# Altium project Ultrascale.PrjPcb (part 3 of 9)

## Sheet JTAG.SchDoc
size A3
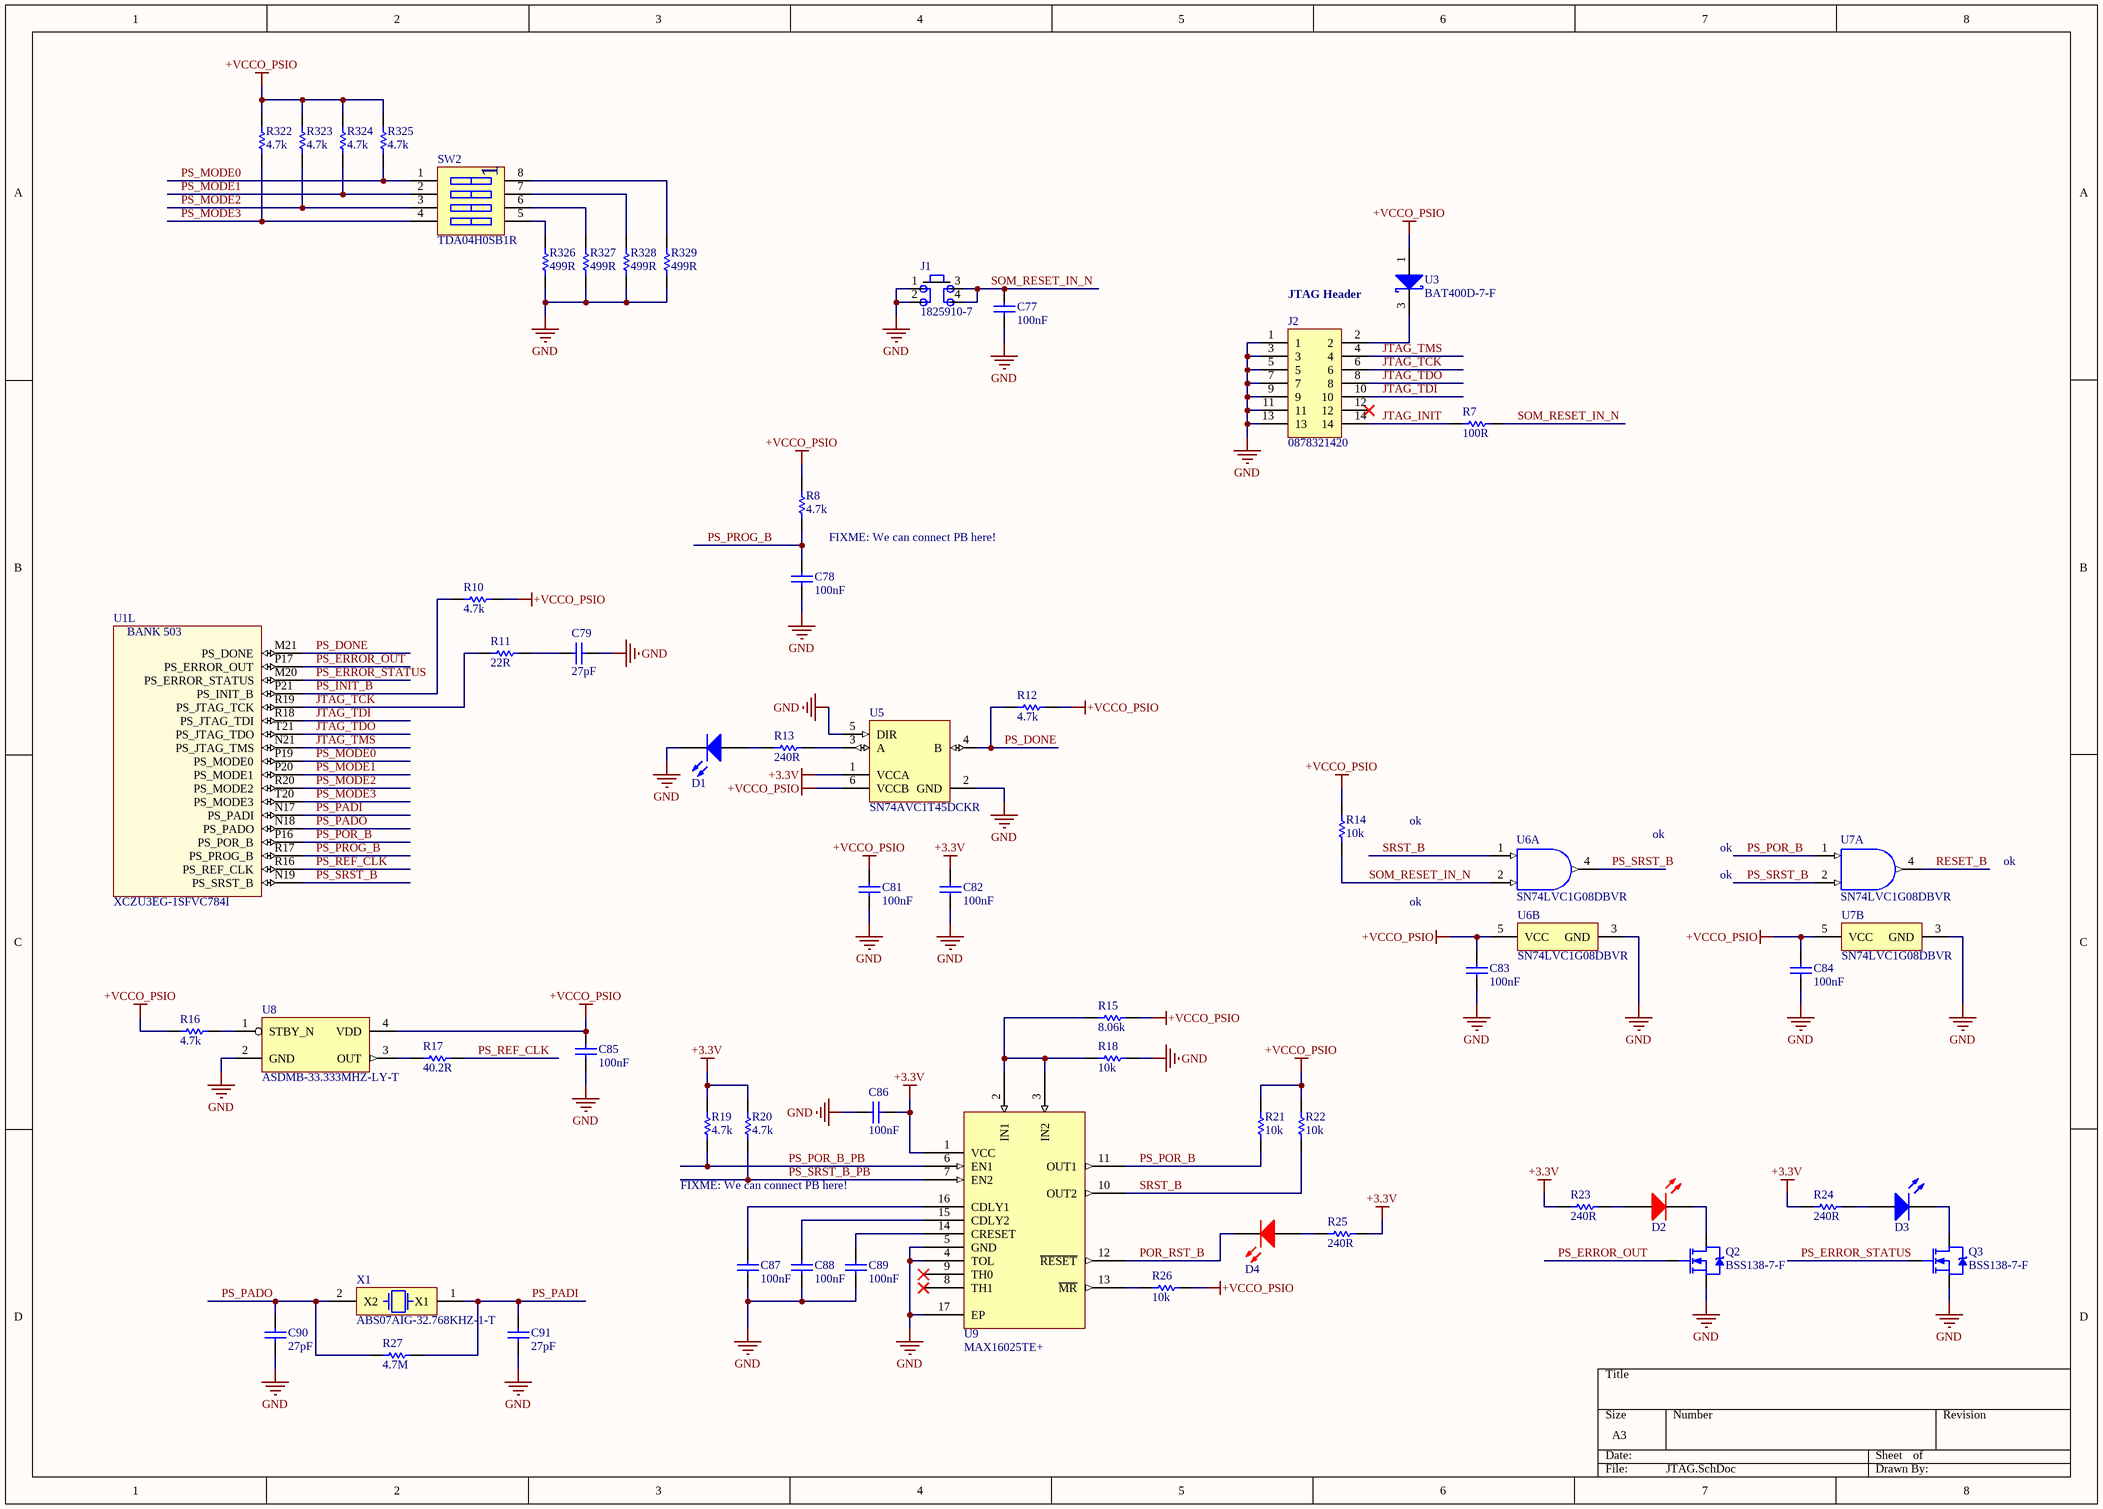
[diagram p7: JTAG.SchDoc]

### Parts
C77  100nF  [CAPC1005L_0402]
C78  100nF  [CAPC1005L_0402]
C79  27pF  [CAPC1005L_0402]
C81  100nF  [CAPC1005L_0402]
C82  100nF  [CAPC1005L_0402]
C83  100nF  [CAPC1005L_0402]
C84  100nF  [CAPC1005L_0402]
C85  100nF  [CAPC1005L_0402]
C86  100nF  [CAPC1005L_0402]
C87  100nF  [CAPC1005L_0402]
C88  100nF  [CAPC1005L_0402]
C89  100nF  [CAPC1005L_0402]
C90  27pF  [CAPC1005L_0402]
C91  27pF  [CAPC1005L_0402]
D1  LED0603BLUE  [LED0603BLUE]  (value not drawn)
D2  LED0603RED  [LED0603RED]  (value not drawn)
D3  LED0603GREEN  [LED0603GREEN]  (value not drawn)
D4  LED0603RED  [LED0603RED]  (value not drawn)
J1  1825910-7  [PB_1825910-7]
J2  0878321420  [0878321420]
Q2  BSS138-7-F  [DIODES_SOT23]
Q3  BSS138-7-F  [DIODES_SOT23]
R7  value 100R  [RESC1005L_0402]  (hidden comment: RES0402_100R_0W1_1T)
R8  value 4.7k  [RESC1005L_0402]  (hidden comment: RES0402_4K7_0W1_1T)
R10  value 4.7k  [RESC1005L_0402]  (hidden comment: RES0402_4K7_0W1_1T)
R11  value 22R  [RESC1005L_0402]  (hidden comment: RES0402_22R_0W1_1T)
R12  value 4.7k  [RESC1005L_0402]  (hidden comment: RES0402_4K7_0W1_1T)
R13  value 240R  [RESC1005L_0402]  (hidden comment: RES0402_240R_0W1_1T)
R14  value 10k  [RESC1005L_0402]  (hidden comment: RES0402_10K_0W1_05T)
R15  value 8.06k  [RESC1005L_0402]  (hidden comment: RES0402_8K06_0W1_1T)
R16  value 4.7k  [RESC1005L_0402]  (hidden comment: RES0402_4K7_0W1_1T)
R17  value 40.2R  [RESC1005L_0402]  (hidden comment: RES0402_40R2_0W1_1T)
R18  value 10k  [RESC1005L_0402]  (hidden comment: RES0402_10K_0W1_05T)
R19  value 4.7k  [RESC1005L_0402]  (hidden comment: RES0402_4K7_0W1_1T)
R20  value 4.7k  [RESC1005L_0402]  (hidden comment: RES0402_4K7_0W1_1T)
R21  value 10k  [RESC1005L_0402]  (hidden comment: RES0402_10K_0W1_05T)
R22  value 10k  [RESC1005L_0402]  (hidden comment: RES0402_10K_0W1_05T)
R23  value 240R  [RESC1005L_0402]  (hidden comment: RES0402_240R_0W1_1T)
R24  value 240R  [RESC1005L_0402]  (hidden comment: RES0402_240R_0W1_1T)
R25  value 240R  [RESC1005L_0402]  (hidden comment: RES0402_240R_0W1_1T)
R26  value 10k  [RESC1005L_0402]  (hidden comment: RES0402_10K_0W1_05T)
R27  value 4.7M  [RESC1005L_0402]  (hidden comment: RES0402_4M7_0W1_5T)
R322  value 4.7k  [RESC1005L_0402]  (hidden comment: RES0402_4K7_0W1_1T)
R323  value 4.7k  [RESC1005L_0402]  (hidden comment: RES0402_4K7_0W1_1T)
R324  value 4.7k  [RESC1005L_0402]  (hidden comment: RES0402_4K7_0W1_1T)
R325  value 4.7k  [RESC1005L_0402]  (hidden comment: RES0402_4K7_0W1_1T)
R326  value 499R  [RESC1005L_0402]  (hidden comment: RES0402_499R_0W1_1T)
R327  value 499R  [RESC1005L_0402]  (hidden comment: RES0402_499R_0W1_1T)
R328  value 499R  [RESC1005L_0402]  (hidden comment: RES0402_499R_0W1_1T)
R329  value 499R  [RESC1005L_0402]  (hidden comment: RES0402_499R_0W1_1T)
SW2  TDA04H0SB1R  [4POS_DIP_SWITCH]
U1  XCZU3EG-1SFVC784I  [BGA784x28]  (part L of 22)
U3  BAT400D-7-F  [BAT400D-7-F _SOT23]
U5  SN74AVC1T45DCKR  [DCK0006A_N]
U6  SN74LVC1G08DBVR  [DBV0005A_N]  (parts A,B of 2)
U7  SN74LVC1G08DBVR  [DBV0005A_N]  (parts A,B of 2)
U8  ASDMB-33.333MHZ-LY-T  [ASDMB]
U9  MAX16025TE+  [T1644+4_L]
X1  ABS07AIG-32.768KHZ-1-T  [ABS07]

### Nets
+3.3V: C82.1 C86.1 R19.1 R20.1 R23.1 R24.1 R25.2 U5.1(VCCA) U9.1(VCC)
+VCCO_PSIO: C81.1 C83.1 C84.1 C85.1 R8.1 R10.2 R12.2 R14.1 R15.2 R16.1 R21.1 R22.1 R26.1 R322.2 R323.2 R324.2 R325.2 U3.1(A) U5.6(VCCB) U6.5(VCC) U7.5(VCC) U8.4(VDD)  [project net +VCCAUX]
GND: C77.1 C78.2 C79.2 C81.2 C82.2 C83.2 C84.2 C85.2 C86.2 C87.2 C88.2 C89.2 C90.2 C91.2 D1.2(K) J1.1 J1.2 J2.1 J2.3 J2.5 J2.7 J2.9 J2.11 J2.13 Q2.S Q3.S R18.2 R326.2 R327.2 R328.2 R329.2 U5.2(GND) U5.5(DIR) U6.3(GND) U7.3(GND) U8.2(GND) U9.4(TOL) U9.5(GND) U9.17(EP)
JTAG_INIT: J2.14 R7.1
JTAG_TCK: J2.6 R11.1 U1.R19(PS_JTAG_TCK)
JTAG_TDI: J2.10 U1.R18(PS_JTAG_TDI)
JTAG_TDO: J2.8 U1.T21(PS_JTAG_TDO)
JTAG_TMS: J2.4 U1.N21(PS_JTAG_TMS)
POR_RST_B: D4.2(K) U9.12(~{RESET})
PS_DONE: R12.1 U1.M21(PS_DONE) U5.4(B)
PS_ERROR_OUT: Q2.G U1.P17(PS_ERROR_OUT)
PS_ERROR_STATUS: Q3.G U1.M20(PS_ERROR_STATUS)
PS_INIT_B: R10.1 U1.P21(PS_INIT_B)
PS_MODE0: R325.1 SW2.1 U1.P19(PS_MODE0)
PS_MODE1: R324.1 SW2.2 U1.P20(PS_MODE1)
PS_MODE2: R323.1 SW2.3 U1.R20(PS_MODE2)
PS_MODE3: R322.1 SW2.4 U1.T20(PS_MODE3)
PS_PADI: C91.1 R27.2 U1.N17(PS_PADI) X1.1(X1)
PS_PADO: C90.1 R27.1 U1.N18(PS_PADO) X1.2(X2)
PS_POR_B: R21.2 U1.P16(PS_POR_B) U7.1(A) U9.11(OUT1)
PS_POR_B_PB: R19.2 U9.6(EN1)
PS_PROG_B: C78.1 R8.2 U1.R17(PS_PROG_B)
PS_REF_CLK: R17.2 U1.R16(PS_REF_CLK)
PS_SRST_B: U1.N19(PS_SRST_B) U6.4(Y) U7.2(B)
PS_SRST_B_PB: R20.2 U9.7(EN2)
RESET_B: U7.4(Y)
SOM_RESET_IN_N: C77.2 J1.3 J1.4 R7.2 R14.2 U6.2(B)
SRST_B: R22.2 U6.1(A) U9.10(OUT2)
NetC79_1: C79.1 R11.2
NetC87_1: C87.1 U9.16(CDLY1)
NetC88_1: C88.1 U9.15(CDLY2)
NetC89_1: C89.1 U9.14(CRESET)
NetD1_1: D1.1(A) R13.1
NetD2_1: D2.1(A) R23.2
NetD2_2: D2.2(K) Q2.D
NetD3_1: D3.1(A) R24.2
NetD3_2: D3.2(K) Q3.D
NetD4_1: D4.1(A) R25.1
NetJ2_2: J2.2 U3.3(K)
NetR13_2: R13.2 U5.3(A)
NetR15_1: R15.1 R18.1 U9.2(IN1) U9.3(IN2)
NetR16_2: R16.2 U8.1(STBY_N)
NetR17_1: R17.1 U8.3(OUT)
NetR26_2: R26.2 U9.13(~{MR})
NetR326_1: R326.1 SW2.5
NetR327_1: R327.1 SW2.6
NetR328_1: R328.1 SW2.7
NetR329_1: R329.1 SW2.8

Not connected (* = marked no-connect by the designer): J2 12*; U9 8(TH1)* 9(TH0)*

### Notes on the sheet
- JTAG Header
- FIXME: We can connect PB here!
- ok
- (in symbol XCZU3EG-1SFVC784I, part L) BANK 503

### Library data of the parts
C77 C78 C81-C89 = CAPCER0402X7R100N25V_10T: CAP CER 0.1UF 25V X7R 0402; Manufacturer 1: Murata Electronics North America; Manufacturer Part Number 1: GRM155R71E104KE14D; Tolerance: 10%; Package: 0402; ComponentLink1Description: Datasheet; Value: 100nF; Voltage: 25V; Temperature Coefficient: X7R; Supplier 1: Digi-Key; Supplier Part Number 1: 490-10698-1-ND; Operating Temperature: -55°C ~ 125°C
C79 C90 C91 = CAPCER0402C0G27P50V_5T: CAP CER 27PF 50V C0G/NP0 0402; Manufacturer 1: Murata Electronics North America; Manufacturer Part Number 1: GRM1555C1H270JA01D; Tolerance: 5%; Package: 0402; ComponentLink1Description: Datasheet; Value: 27pF; Voltage: 50V; Temperature Coefficient: C0G/NP0; Supplier 1: Digi-Key; Supplier Part Number 1: 490-5869-1-ND; Operating Temperature: -55°C ~ 125°C
D1 = LED0603BLUE: LED BLUE DIFFUSED 0603 SMD; Manufacturer 1: Broadcom Limited; Manufacturer Part Number 1: HSMR-C191; Voltage - Forward (Vf) (Typ): 3.4V; Current - Test: 20mA; Package: 0603; Supplier 1: Digi-Key; Supplier Part Number 1: 516-2523-1-ND; ComponentLink1Description: Datasheet; ComponentLink1URL: C:\Users\Public\Documents\Altium\AD16\Library\PDF\AV02-0592EN0.pdf
D2 D4 = LED0603RED: LED RED DIFFUSED 0603 SMD; Manufacturer 1: Broadcom Limited; Manufacturer Part Number 1: HSMH-C191; Voltage - Forward (Vf) (Typ): 1.8V; Current - Test: 20mA; Package: 0603; Supplier 1: Digi-Key; Supplier Part Number 1: 516-3067-1-ND; ComponentLink1Description: Datasheet; ComponentLink1URL: C:\Users\Public\Documents\Altium\AD16\Library\PDF\AV02-0592EN0.pdf
D3 = LED0603GREEN: LED GREEN DIFFUSED 0603 SMD; Manufacturer 1: Broadcom Limited; Manufacturer Part Number 1: HSMM-C190; Voltage - Forward (Vf) (Typ): 3.3V; Current - Test: 20mA; Package: 0603; Supplier 1: Digi-Key; Supplier Part Number 1: 516-2833-1-ND; ComponentLink1Description: Datasheet; ComponentLink1URL: C:\Users\Public\Documents\Altium\AD16\Library\PDF\AV02-0592EN0.pdf
J1 = 1825910-7: SWITCH TACTILE SPST-NO 0.05A 24V; Manufacturer 1: TE Connectivity ALCOSWITCH Switches; Opearating Temperature: -35°C ~ 85°C; ComponentLink1Description: Drawing; ComponentLink1URL: C:\Users\Public\Documents\Altium\AD16\Library\PDF\ENG_CD_1825910_C10.pdf; Supplier 1: Digi-Key; Manufacturer Part Number 1: 1825910-7; Supplier Part Number 1: 450-1804-ND
J2 = 0878321420: CONN HEADER 14POS 2MM VERT SMD; Manufacturer 1: Molex, LLC; Number of Positions: 14; Supplier 1: Digi-Key; Manufacturer Part Number 1: 0878321420; Pitch: 2mm; Number of Rows: 2; ComponentLink1URL: C:\Users\Public\Documents\Altium\AD16\Library\PDF\878322620_sd.pdf; ComponentLink1Description: Drawing; Supplier Part Number 1: 952-1809-ND
Q2 Q3 = BSS138-7-F: MOSFET N-CH 50V 200MA SOT23-3; Manufacturer 1: Diodes Incorporated; ComponentLink1Description: Datasheet; ComponentLink1URL: C:\Users\Public\Documents\Altium\AD16\Library\PDF\ds30144.pdf; Supplier 1: Digi-Key; Supplier Part Number 1: BSS138-FDICT-ND; Manufacturer Part Number 1: BSS138-7-F; Operating Temperature: -55°C ~ 150°C (TJ)
R7 = RES0402_100R_0W1_1T: RES SMD 100 OHM 1% 1/10W 0402; Manufacturer 1: Panasonic Electronic Components; Manufacturer Part Number 1: ERJ-2RKF1000X; Package: 0402; ComponentLink1Description: Datasheet; Power: 1/10W; Tolerance: 1%; Supplier 1: Digi-Key; Supplier Part Number 1: P100LCT-ND
R8 R10 R12 R16 R19 R20 R322-R325 = RES0402_4K7_0W1_1T: RES SMD 4.7K OHM 1% 1/10W 0402; Manufacturer 1: Panasonic Electronic Components; Manufacturer Part Number 1: ERJ-2RKF4701X; Package: 0402; ComponentLink1Description: Datasheet; Power: 1/10W; Tolerance: 1%; Supplier 1: Digi-Key; Supplier Part Number 1: P4.70KLCT-ND
R11 = RES0402_22R_0W1_1T: RES SMD 22 OHM 1% 1/10W 0402; Manufacturer 1: Panasonic Electronic Components; Manufacturer Part Number 1: ERJ-2RKF22R0X; Package: 0402; ComponentLink1Description: Datasheet; Power: 1/10W; Tolerance: 1%; Supplier 1: Digi-Key; Supplier Part Number 1: P22.0LCT-ND
R13 R23-R25 = RES0402_240R_0W1_1T: RES SMD 240 OHM 1% 1/10W 0402; Manufacturer 1: Panasonic Electronic Components; Manufacturer Part Number 1: ERJ-2RKF2400X; Package: 0402; ComponentLink1Description: Datasheet; Power: 1/10W; Tolerance: 1%; Supplier 1: Digi-Key; Supplier Part Number 1: P240LCT-ND
R14 R18 R21 R22 R26 = RES0402_10K_0W1_05T: RES SMD 10K OHM 0.5% 1/16W 0402; Manufacturer 1: Panasonic Electronic Components; Manufacturer Part Number 1: ERJ-2RHD1002X; Package: 0402; ComponentLink1Description: Datasheet; Power: 1/16W; Tolerance: 0.5%; Supplier 1: Digi-Key; Supplier Part Number 1: P15984CT-ND
R15 = RES0402_8K06_0W1_1T: RES SMD 8.06K OHM 1% 1/10W 0402; Manufacturer 1: Panasonic Electronic Components; Manufacturer Part Number 1: ERJ-2RKF8061X; Package: 0402; ComponentLink1Description: Datasheet; Power: 1/10W; Tolerance: 1%; Supplier 1: Digi-Key; Supplier Part Number 1: P8.06KLCT-ND
R17 = RES0402_40R2_0W1_1T: RES SMD 40.2 OHM 1% 1/10W 0402; Manufacturer 1: Panasonic Electronic Components; Manufacturer Part Number 1: ERJ-2RKF40R2X; Package: 0402; ComponentLink1Description: Datasheet; Power: 1/10W; Tolerance: 1%; Supplier 1: Digi-Key; Supplier Part Number 1: P40.2LCT-ND
R27 = RES0402_4M7_0W1_5T: RES SMD 4.7M OHM 5% 1/16W 0402; Manufacturer 1: Vishay Dale; Manufacturer Part Number 1: CRCW04024M70JNED; Power: 1/10W; Package: 0402; ComponentLink1Description: Datasheet; Tolerance: 5%; Supplier 1: Digi-Key; Supplier Part Number 1: 541-4.7MJCT-ND
R326-R329 = RES0402_499R_0W1_1T: RES SMD 499 OHM 1% 1/16W 0402; Manufacturer 1: Vishay Dale; Manufacturer Part Number 1: CRCW0402499RFKTD; Power: 1/10W; Package: 0402; ComponentLink1Description: Datasheet; Tolerance: 1%; Supplier 1: Digi-Key; Supplier Part Number 1: 541-2962-1-ND
SW2 = TDA04H0SB1R: SWITCH SLIDE DIP SPST 25MA 24V; Manufacturer 1: C&K; Pitch: 1.27mm; Number of Contact: 4; Supplier 1: Digi-Key; Manufacturer Part Number 1: TDA04H0SB1R; ComponentLink1URL: C:\Users\Public\Documents\Altium\AD16\Library\PDF\tda.pdf; ComponentLink1Description: Drawing; Supplier Part Number 1: CKN9502CT-ND
U1 = XCZU3EG-1SFVC784I: IC FPGA 252 I/O 784FCBGA - XILINX ZYNQ ULTRASCALE+; Manufacturer 1: Xilinx Inc.; Package: SFVC784; ComponentLink1Description: Datasheet; Supplier 1: Digi-Key; Supplier Part Number 1: XCZU3EG-1SFVC784I-ND; Manufacturer Part Number 1: XCZU3EG-1SFVC784I
U3 = BAT400D-7-F: DIODE SCHOTTKY 40V 500MA SOT23-3; Manufacturer 1: Diodes Incorporated; ComponentLink1Description: Datasheet; ComponentLink1URL: C:\Users\Public\Documents\Altium\AD16\Library\PDF\ds30182.pdf; Supplier 1: Digi-Key; Supplier Part Number 1: BAT400D-FDICT-ND; Manufacturer Part Number 1: BAT400D-7-F; Operating Temperature: -40°C ~ 125°C
U5 = SN74AVC1T45DCKR: Single-Bit Dual-Supply Bus Transceiver with Configurable Voltage Translation and 3-State Outputs, DCK0006A, LARGE T&R; Manufacturer 1: Texas Instruments; VCC(Min)(V): 1.2; VCC(Max)(V): 3.6; Output Type: CMOS; Logic: True; ICC @ Nom Voltage(Max)(mA): 0.0009; Bits(#): 1; F @ Nom Voltage(Max)(Mhz): 100; Rating: Catalog; Technology Family: AVC; Voltage(Nom)(V): 1.2,1.5,1.8,2.5,3.3; Schmitt Trigger: No; Output Drive (IOL/IOH)(Max)(mA): 12/-12; Sub-Family: Dual Supply Translator; 3-State Output: Yes; tpd @ Nom Voltage(Max)(ns): 2.9,5.6,5.2,4.2,3.8; DatasheetVersion: SCES530H; PackageReference: DCK0006A; Supplier 2: Mouser; Supplier Part Number 2: 595-SN74AVC1T45DCKR; Supplier 1: Digi-Key; Supplier Part Number 1: 296-17992-2-ND; Supplier 3: Digi-Key; Supplier Part Number 3: 296-17992-1-ND; Supplier 4: Digi-Key; Supplier Part Number 4: 296-17992-6-ND; Generic Part Number: SN74AVC1T45; Input Type: CMOS; Operating Temperature Range(C): -40 to 85; Manufacturer Part Number 1: SN74AVC1T45DCKR; ComponentLink1Description: Manufacturer URL; ComponentLink1URL: C:\Users\Public\Documents\Altium\AD16\Library\PDF\sn74avc1t45.pdf
U6 U7 = SN74LVC1G08DBVR: Single 2-Input Positive-AND Gate, DBV0005A, LARGE T&R; Manufacturer 1: Texas Instruments; VCC(Min)(V): 1.65; VCC(Max)(V): 5.5; Output Type: CMOS; ICC @ Nom Voltage(Max)(mA): 0.01; Input Type: CMOS/TTL; Bits(#): 1; F @ Nom Voltage(Max)(Mhz): 150; Rating: Catalog; Technology Family: LVC; Voltage(Nom)(V): 1.8,2.5,3.3,5; Schmitt Trigger: No; Output Drive (IOL/IOH)(Max)(mA): 32/-32; tpd @ Nom Voltage(Max)(ns): 4.5,6,4,5; Logic: True; Gate Type: AND; DatasheetVersion: SCES217Y; PackageReference: DBV0005A; Supplier 2: Mouser; Supplier Part Number 2: 595-SN74LVC1G08DBVR; Supplier 1: Digi-Key; Supplier Part Number 1: 296-11601-2-ND; Supplier 3: Digi-Key; Supplier Part Number 3: 296-11601-1-ND; Supplier 4: Digi-Key; Supplier Part Number 4: 296-11601-6-ND; Generic Part Number: SN74LVC1G08; Operating Temperature: -40°C ~ 125°C; Sub-Family: AND Gate; 3-State Output: No; Manufacturer Part Number 1: SN74LVC1G08DBVR; ComponentLink1Description: Manufacturer URL; ComponentLink1URL: C:\Users\Public\Documents\Altium\AD16\Library\PDF\sn74lvc1g08.pdf
U8 = ASDMB-33.333MHZ-LY-T: OSC MEMS 33.333MHZ CMOS SMD; Manufacturer 1: Abracon LLC; Frequency Stability: ±10ppm; ComponentLink1Description: Datasheet; ComponentLink1URL: C:\Users\Public\Documents\Altium\AD16\Library\PDF\ASDMB.pdf; Supplier 1: Digi-Key; Supplier Part Number 1: 535-11196-1-ND; Manufacturer Part Number 1: ASDMB-33.333MHZ-LY-T; Operating Temperature: -40°C ~ 85°C; Frequency: 33.333MHz
U9 = MAX16025TE+: IC SUPERVISORY CIRC DL 16TQFN; Manufacturer 1: Maxim Integrated; ComponentLink1Description: Datasheet; ComponentLink1URL: C:\Users\Public\Documents\Altium\AD16\Library\PDF\MAX16025-MAX16030.pdf; Supplier 1: Digi-Key; Supplier Part Number 1: MAX16025TE+-ND; Manufacturer Part Number 1: MAX16025TE+; Operating Temperature: -40°C ~ 125°C (TA)
X1 = ABS07AIG-32.768KHZ-1-T: CRYSTAL 32.768KHZ 12.5PF SMD; Manufacturer 1: Abracon LLC; Frequency Tolerance: ±10ppm; ComponentLink1Description: Datasheet; ComponentLink1URL: C:\Users\Public\Documents\Altium\AD16\Library\PDF\ABS07.pdf; Supplier 1: Digi-Key; Supplier Part Number 1: 535-13352-1-ND; Manufacturer Part Number 1: ABS07AIG-32.768KHZ-1-T; Operating Temperature: -40°C ~ 125°C; Load Capacitance: 12.5pF; Frequency: 32.768kHz

## Sheet SYSMON.SchDoc
size A3
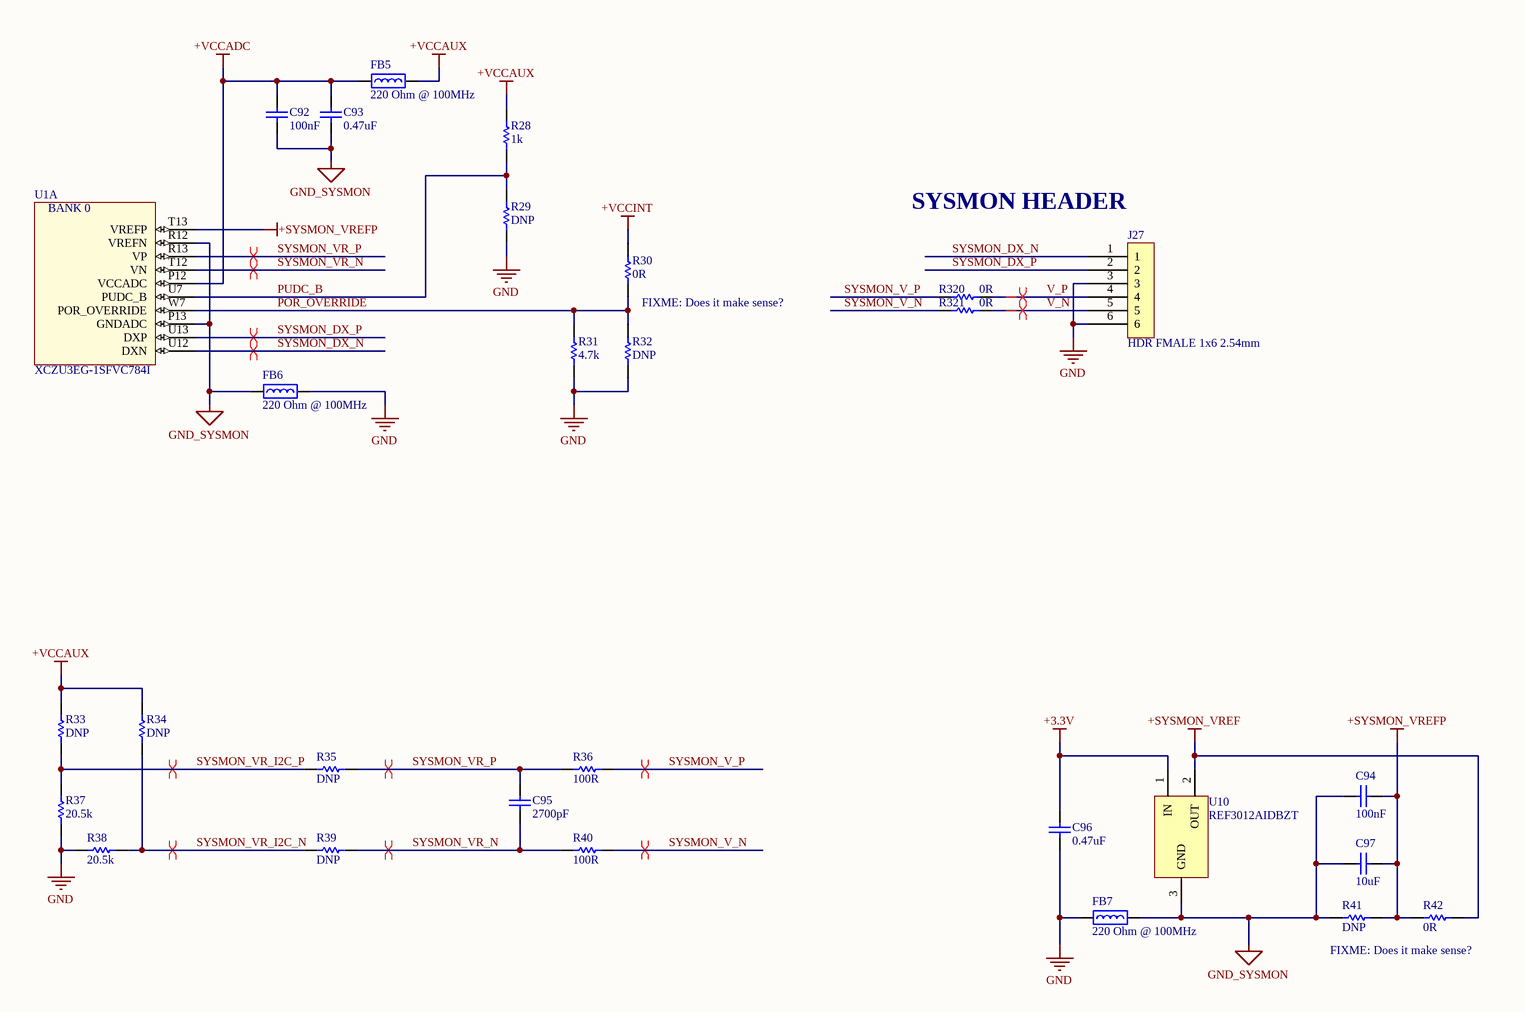
[diagram p8: SYSMON.SchDoc]

### Parts
C92  100nF  [CAPC1005L_0402]
C93  0.47uF  [CAPC1005L_0402]
C94  100nF  [CAPC1005L_0402]
C95  2700pF  [CAPC1005L_0402]
C96  0.47uF  [CAPC1005L_0402]
C97  10uF  [CAPC1005L_0402]
FB5  Impedance @ Frequency: 220 Ohm @ 100MHz  [INDC1608N_0603]  (hidden comment: BEAD0603_220_2A5_40M)
FB6  Impedance @ Frequency: 220 Ohm @ 100MHz  [INDC1608N_0603]  (hidden comment: BEAD0603_220_2A5_40M)
FB7  Impedance @ Frequency: 220 Ohm @ 100MHz  [INDC1608N_0603]  (hidden comment: BEAD0603_220_2A5_40M)
J27  HDR FMALE 1x6 2.54mm  [Hdr_Female_1x6_2.54mm]
R28  value 1k  [RESC1005L_0402]  (hidden comment: RES0402_1K_0W1_1T)
R29  value DNP  [RESC1005L_0402]  (hidden comment: RES0402)
R30  value 0R  [RESC1005L_0402]  (hidden comment: RES0402_0R_0W1)
R31  value 4.7k  [RESC1005L_0402]  (hidden comment: RES0402_4K7_0W1_1T)
R32  value DNP  [RESC1005L_0402]  (hidden comment: RES0402)
R33  value DNP  [RESC1005L_0402]  (hidden comment: RES0402)
R34  value DNP  [RESC1005L_0402]  (hidden comment: RES0402)
R35  value DNP  [RESC1005L_0402]  (hidden comment: RES0402)
R36  value 100R  [RESC1005L_0402]  (hidden comment: RES0402_100R_0W1_1T)
R37  value 20.5k  [RESC1005L_0402]  (hidden comment: RES0402_20K5_0W1_1T)
R38  value 20.5k  [RESC1005L_0402]  (hidden comment: RES0402_20K5_0W1_1T)
R39  value DNP  [RESC1005L_0402]  (hidden comment: RES0402)
R40  value 100R  [RESC1005L_0402]  (hidden comment: RES0402_100R_0W1_1T)
R41  value DNP  [RESC1005L_0402]  (hidden comment: RES0402)
R42  value 0R  [RESC1005L_0402]  (hidden comment: RES0402_0R_0W1)
R320  value 0R  [RESC1005L_0402]  (hidden comment: RES0402_0R_0W1)
R321  value 0R  [RESC1005L_0402]  (hidden comment: RES0402_0R_0W1)
U1  XCZU3EG-1SFVC784I  [BGA784x28]  (part A of 22)
U10  REF3012AIDBZT  [TI-DBZ3_N]

### Nets
+3.3V: C96.1 U10.1(IN)
+SYSMON_VREF: R42.1 U10.2(OUT)
+SYSMON_VREFP: C94.1 C97.2 R41.1 R42.2 U1.T13(VREFP)
+VCCADC: C92.1 C93.1 FB5.1 U1.P12(VCCADC)
+VCCAUX: FB5.2 R28.1 R33.1 R34.1
+VCCINT: R30.1
GND: C96.2 FB6.2 FB7.1 J27.3 J27.6 R29.2 R31.2 R32.2 R37.2 R38.2
GND_SYSMON: C92.2 C93.2 C94.2 C97.1 FB6.1 FB7.2 R41.2 U1.P13(GNDADC) U1.R12(VREFN) U10.3(GND)
POR_OVERRIDE: R30.2 R31.1 R32.1 U1.W7(POR_OVERRIDE)
PUDC_B: R28.2 R29.1 U1.U7(PUDC_B)
SYSMON_DX_N: J27.1 U1.U12(DXN)
SYSMON_DX_P: J27.2 U1.U13(DXP)
SYSMON_V_N: R40.2 R321.1
SYSMON_V_P: R36.2 R320.1
SYSMON_VR_I2C_N: R34.2 R38.1 R39.2
SYSMON_VR_I2C_P: R33.2 R35.2 R37.1
SYSMON_VR_N: C95.2 R39.1 R40.1 U1.T12(VN)
SYSMON_VR_P: C95.1 R35.1 R36.1 U1.R13(VP)
V_N: J27.5 R321.2
V_P: J27.4 R320.2

### Layout directives
differential pair: SYSMON_DX_N, SYSMON_DX_P, SYSMON_V_N, SYSMON_V_P, SYSMON_VR_I2C_N, SYSMON_VR_I2C_P, SYSMON_VR_N, SYSMON_VR_P, V_N, V_P

### Notes on the sheet
- SYSMON HEADER
- FIXME: Does it make sense?
- (in symbol XCZU3EG-1SFVC784I, part A) BANK 0

### Library data of the parts
C92 C94 = CAPCER0402X7R100N25V_10T: as C77 on sheet JTAG; Package: 0402; ComponentLink1Description: Datasheet; Value: 100nF; Voltage: 25V; Temperature Coefficient: X7R; Supplier 1: Digi-Key; Supplier Part Number 1: 490-10698-1-ND; Operating Temperature: -55°C ~ 125°C
C93 C96 = CAPCER0402X5R0U4710V_10T: CAP CER 0.47UF 10V X5R 0402; Manufacturer 1: Murata Electronics North America; Manufacturer Part Number 1: GRM155R61A474KE15D; Tolerance: 10%; Package: 0402; ComponentLink1Description: Datasheet; Value: 0.47uF; Voltage: 10V; Temperature Coefficient: X5R; Supplier 1: Digi-Key; Supplier Part Number 1: 490-3264-1-ND; Operating Temperature: -55°C ~ 85°C
C95 = CAPCER0402X7R2700P50V_10T: CAP CER 2700PF 50V X7R 0402; Manufacturer 1: Murata Electronics North America; Manufacturer Part Number 1: GRM155R71H272KA01D; Tolerance: 10%; Package: 0402; ComponentLink1Description: Datasheet; Value: 2700pF; Voltage: 50V; Temperature Coefficient: X7R; Supplier 1: Digi-Key; Supplier Part Number 1: 490-1306-1-ND; Operating Temperature: -55°C ~ 125°C
C97 = CAPCER0402X5R10U10V_20T: CAP CER 10UF 10V X5R 0402; Manufacturer 1: Samsung Electro-Mechanics America, Inc.; Manufacturer Part Number 1: CL05A106MP5NUNC; Tolerance: 20%; Package: 0402; ComponentLink1Description: Datasheet; Value: 10uF; Voltage: 10V; Temperature Coefficient: X5R; Supplier 1: Digi-Key; Supplier Part Number 1: 1276-1450-1-ND; Operating Temperature: -55°C ~ 85°C
FB5-FB7 = BEAD0603_220_2A5_40M: FERRITE BEAD 220 OHM 0603 1LN; Manufacturer 1: Murata Electronics North America; Manufacturer Part Number 1: BLM18SG221TN1D; Current Rating (Max): 2.5A; DC Resistance (DCR) (Max): 40 mohm; Package: 0603; ComponentLink1Description: Datasheet; ComponentLink1URL: C:\Users\Public\Documents\Altium\AD16\Library\PDF\ENFA0003.pdf; Supplier 1: Digi-Key; Supplier Part Number 1: 490-5225-1-ND; Operating Temperature: -55°C ~ 125°C
J27 = M20-7820646: 06-WAY SIL VERT SOCKET L/FREE; Manufacturer 1: Harwin Inc; Connector Type: Receptacle; Number of Positions: 6; Number of Positions Loaded: All; Pitch: 0.100" (2.54mm); .Checked PCB: MM; Supplier 1: Digi-Key; Manufacturer Part Number 1: M20-7820646; RoHS: RoHS Compliant; Category: Connectors, Interconnects; Stock 1: 87; Pricing 1: 1=0.96, 38=0.79211, 76=0.75895, 114=0.72596, 266=0.66, 532=0.594, 1026=0.528, 2508=0.4785 (USD); Packaging: Tube; Contact Type: Female Socket; Number of Rows: 1; Row Spacing: -; Mounting Type: Through Hole; Termination: Solder; Fastening Type: -; Features: -; Contact Finish: Tin; Contact Finish Thickness: -; Color: Black; ComponentLink1URL: http://harwin.com/includes/pdfs/M20-782.pdf; ComponentLink1Description: http://harwin.com/includes/pdfs/M20-782.pdf; Supplier Part Number 1: 952-1809-ND; .Checked SCH: MM; .Creator: MM
R28 = RES0402_1K_0W1_1T: RES SMD 1K OHM 1% 1/10W 0402; Manufacturer 1: Panasonic Electronic Components; Manufacturer Part Number 1: ERJ-2RKF1001X; Package: 0402; ComponentLink1Description: Datasheet; Power: 1/10W; Tolerance: 1%; Supplier 1: Digi-Key; Supplier Part Number 1: P1.00KLCT-ND
R29 R32-R35 R39 R41 = RES0402: RES SMD 0402 Footprint; Package: 0402; ComponentLink1Description: Datasheet; Tolerance: -
R30 R42 R320 R321 = RES0402_0R_0W1: RES SMD 0 OHM JUMPER 1/10W 0402; Manufacturer 1: Panasonic Electronic Components; Manufacturer Part Number 1: ERJ-2GE0R00X; Package: 0402; ComponentLink1Description: Datasheet; Power: 1/10W; Tolerance: -; Supplier 1: Digi-Key; Supplier Part Number 1: P0.0JCT-ND
R31 = RES0402_4K7_0W1_1T: as R8 on sheet JTAG; Package: 0402; ComponentLink1Description: Datasheet; Power: 1/10W; Tolerance: 1%; Supplier 1: Digi-Key; Supplier Part Number 1: P4.70KLCT-ND
R36 R40 = RES0402_100R_0W1_1T: as R7 on sheet JTAG; Package: 0402; ComponentLink1Description: Datasheet; Power: 1/10W; Tolerance: 1%; Supplier 1: Digi-Key; Supplier Part Number 1: P100LCT-ND
R37 R38 = RES0402_20K5_0W1_1T: RES SMD 20.5K OHM 1% 1/10W 0402; Manufacturer 1: Panasonic Electronic Components; Manufacturer Part Number 1: ERJ-2RKF2052X; Package: 0402; ComponentLink1Description: Datasheet; Power: 1/10W; Tolerance: 1%; Supplier 1: Digi-Key; Supplier Part Number 1: P20.5KLCT-ND
U1 = XCZU3EG-1SFVC784I: as U1 on sheet JTAG; Package: SFVC784; ComponentLink1Description: Datasheet; Supplier 1: Digi-Key; Supplier Part Number 1: XCZU3EG-1SFVC784I-ND; Manufacturer Part Number 1: XCZU3EG-1SFVC784I
U10 = REF3012AIDBZT: IC VREF SERIES 1.25V SOT23-3; Manufacturer 1: Texas Instruments; Voltage - Input: 1.8 V ~ 5.5 V; ComponentLink1Description: Datasheet; ComponentLink1URL: C:\Users\Public\Documents\Altium\AD16\Library\PDF\ref3012.pdf; Supplier 1: Digi-Key; Supplier Part Number 1: REF3012AIDBZTCT-ND; Manufacturer Part Number 1: REF3012AIDBZT; Operating Temperature: -40°C ~ 125°C (TA); Voltage - Output (Min/Fixed): 1.25V

## Sheet PS_DDR4_SODIMM.SchDoc
size A3
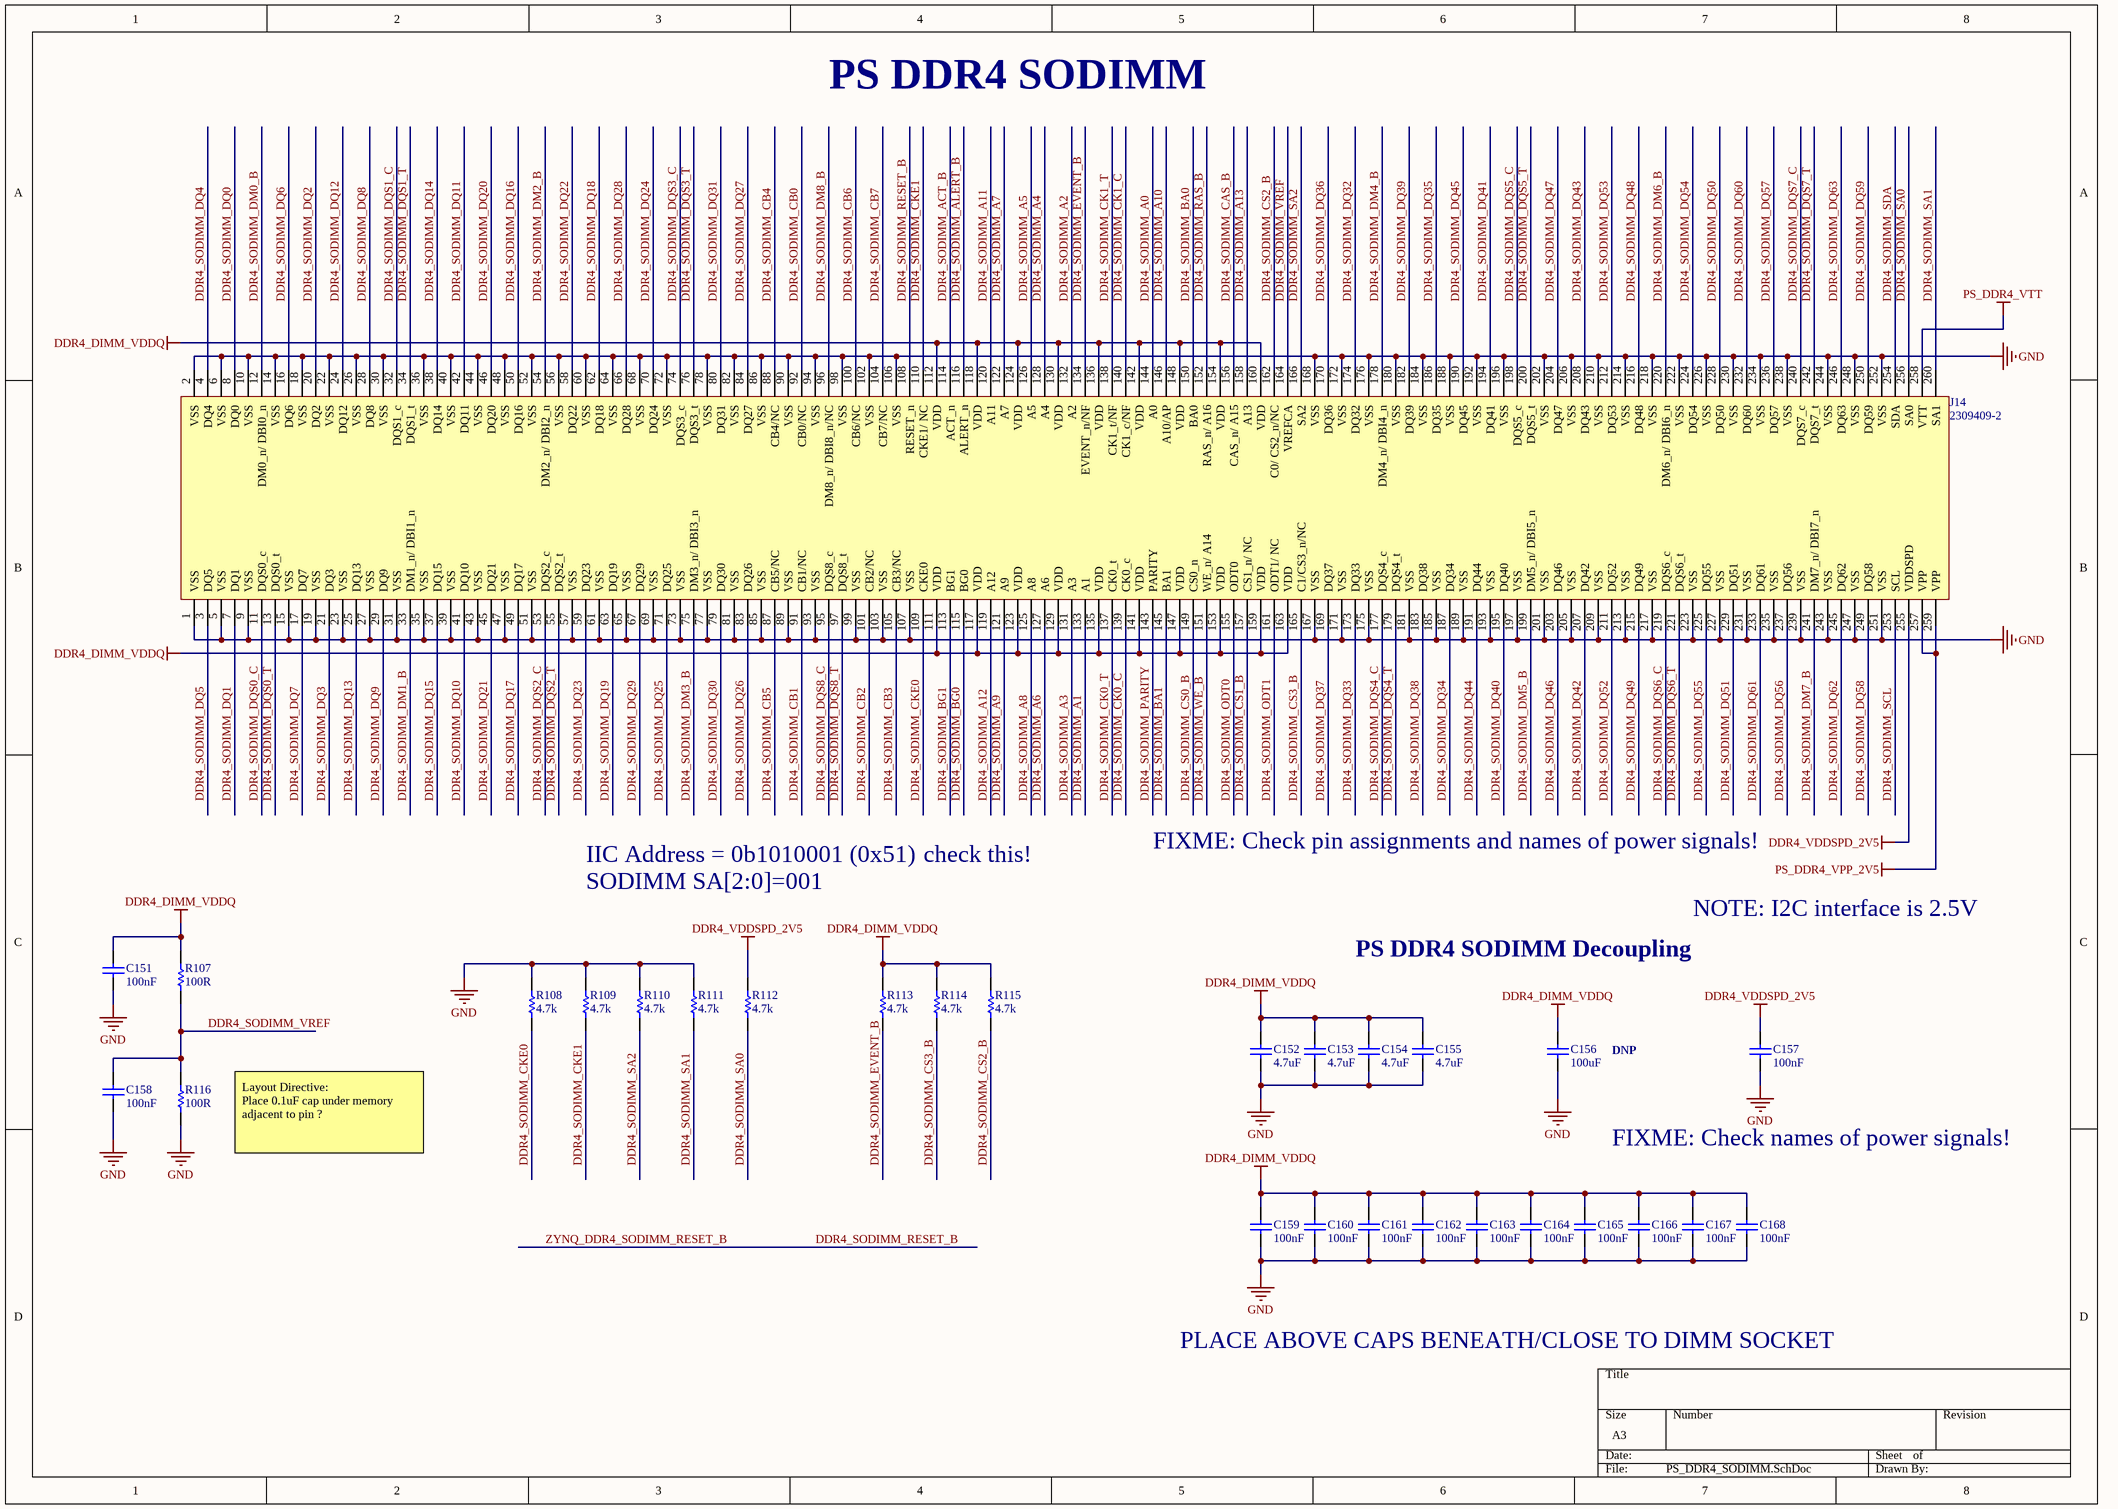
[diagram p9: PS_DDR4_SODIMM.SchDoc]

### Parts
C151  100nF  [CAPC1005L_0402]
C152  4.7uF  [CAPC1005L_0402]
C153  4.7uF  [CAPC1005L_0402]
C154  4.7uF  [CAPC1005L_0402]
C155  4.7uF  [CAPC1005L_0402]
C156  100uF  [CAPC3225N_1210]
C157  100nF  [CAPC1005L_0402]
C158  100nF  [CAPC1005L_0402]
C159  100nF  [CAPC1005L_0402]
C160  100nF  [CAPC1005L_0402]
C161  100nF  [CAPC1005L_0402]
C162  100nF  [CAPC1005L_0402]
C163  100nF  [CAPC1005L_0402]
C164  100nF  [CAPC1005L_0402]
C165  100nF  [CAPC1005L_0402]
C166  100nF  [CAPC1005L_0402]
C167  100nF  [CAPC1005L_0402]
C168  100nF  [CAPC1005L_0402]
J14  2309409-2  [DDR4_SODIMM_MATING]
R107  value 100R  [RESC1005L_0402]  (hidden comment: RES0402_100R_0W1_1T)
R108  value 4.7k  [RESC1005L_0402]  (hidden comment: RES0402_4K7_0W1_1T)
R109  value 4.7k  [RESC1005L_0402]  (hidden comment: RES0402_4K7_0W1_1T)
R110  value 4.7k  [RESC1005L_0402]  (hidden comment: RES0402_4K7_0W1_1T)
R111  value 4.7k  [RESC1005L_0402]  (hidden comment: RES0402_4K7_0W1_1T)
R112  value 4.7k  [RESC1005L_0402]  (hidden comment: RES0402_4K7_0W1_1T)
R113  value 4.7k  [RESC1005L_0402]  (hidden comment: RES0402_4K7_0W1_1T)
R114  value 4.7k  [RESC1005L_0402]  (hidden comment: RES0402_4K7_0W1_1T)
R115  value 4.7k  [RESC1005L_0402]  (hidden comment: RES0402_4K7_0W1_1T)
R116  value 100R  [RESC1005L_0402]  (hidden comment: RES0402_100R_0W1_1T)

### Nets
DDR4_DIMM_VDDQ: C151.2 C152.2 C153.2 C154.2 C155.2 C156.2 C159.2 C160.2 C161.2 C162.2 C163.2 C164.2 C165.2 C166.2 C167.2 C168.2 J14.111(VDD) J14.112(VDD) J14.117(VDD) J14.118(VDD) J14.123(VDD) J14.124(VDD) J14.129(VDD) J14.130(VDD) J14.135(VDD) J14.136(VDD) J14.141(VDD) J14.142(VDD) J14.147(VDD) J14.148(VDD) J14.153(VDD) J14.154(VDD) J14.159(VDD) J14.160(VDD) J14.163(VDD) R107.2 R113.2 R114.2 R115.2
DDR4_VDDSPD_2V5: C157.2 J14.255(VDDSPD) R112.2
GND: C151.1 C152.1 C153.1 C154.1 C155.1 C156.1 C157.1 C158.1 C159.1 C160.1 C161.1 C162.1 C163.1 C164.1 C165.1 C166.1 C167.1 C168.1 J14.1(VSS) J14.2(VSS) J14.5(VSS) J14.6(VSS) J14.9(VSS) J14.10(VSS) J14.14(VSS) J14.15(VSS) J14.18(VSS) J14.19(VSS) J14.22(VSS) J14.23(VSS) J14.26(VSS) J14.27(VSS) J14.30(VSS) J14.31(VSS) J14.35(VSS) J14.36(VSS) J14.39(VSS) J14.40(VSS) J14.43(VSS) J14.44(VSS) J14.47(VSS) J14.48(VSS) J14.51(VSS) J14.52(VSS) J14.56(VSS) J14.57(VSS) J14.60(VSS) J14.61(VSS) J14.64(VSS) J14.65(VSS) J14.68(VSS) J14.69(VSS) J14.72(VSS) J14.73(VSS) J14.77(VSS) J14.78(VSS) J14.81(VSS) J14.82(VSS) J14.85(VSS) J14.86(VSS) J14.89(VSS) J14.90(VSS) J14.93(VSS) J14.94(VSS) J14.98(VSS) J14.99(VSS) J14.102(VSS) J14.103(VSS) J14.106(VSS) J14.107(VSS) J14.167(VSS) J14.168(VSS) J14.171(VSS) J14.172(VSS) J14.175(VSS) J14.176(VSS) J14.180(VSS) J14.181(VSS) J14.184(VSS) J14.185(VSS) J14.188(VSS) J14.189(VSS) J14.192(VSS) J14.193(VSS) J14.196(VSS) J14.197(VSS) J14.201(VSS) J14.202(VSS) J14.205(VSS) J14.206(VSS) J14.209(VSS) J14.210(VSS) J14.213(VSS) J14.214(VSS) J14.217(VSS) J14.218(VSS) J14.222(VSS) J14.223(VSS) J14.226(VSS) J14.227(VSS) J14.230(VSS) J14.231(VSS) J14.234(VSS) J14.235(VSS) J14.238(VSS) J14.239(VSS) J14.243(VSS) J14.244(VSS) J14.247(VSS) J14.248(VSS) J14.251(VSS) J14.252(VSS) R108.2 R109.2 R110.2 R111.2 R116.1
PS_DDR4_VPP_2V5: J14.257(VPP) J14.259(VPP)
PS_DDR4_VTT: J14.258(VTT)
DDR4_SODIMM_A0: J14.144(A0)
DDR4_SODIMM_A1: J14.133(A1)
DDR4_SODIMM_A2: J14.132(A2)
DDR4_SODIMM_A3: J14.131(A3)
DDR4_SODIMM_A4: J14.128(A4)
DDR4_SODIMM_A5: J14.126(A5)
DDR4_SODIMM_A6: J14.127(A6)
DDR4_SODIMM_A7: J14.122(A7)
DDR4_SODIMM_A8: J14.125(A8)
DDR4_SODIMM_A9: J14.121(A9)
DDR4_SODIMM_A10: J14.146(A10/AP)
DDR4_SODIMM_A11: J14.120(A11)
DDR4_SODIMM_A12: J14.119(A12)
DDR4_SODIMM_A13: J14.158(A13)
DDR4_SODIMM_ACT_B: J14.114(ACT_n)
DDR4_SODIMM_ALERT_B: J14.116(ALERT_n)
DDR4_SODIMM_BA0: J14.150(BA0)
DDR4_SODIMM_BA1: J14.145(BA1)
DDR4_SODIMM_BG0: J14.115(BG0)
DDR4_SODIMM_BG1: J14.113(BG1)
DDR4_SODIMM_CAS_B: J14.156(CAS_n/_A15)
DDR4_SODIMM_CB0: J14.92(CB0/NC)
DDR4_SODIMM_CB1: J14.91(CB1/NC)
DDR4_SODIMM_CB2: J14.101(CB2/NC)
DDR4_SODIMM_CB3: J14.105(CB3/NC)
DDR4_SODIMM_CB4: J14.88(CB4/NC)
DDR4_SODIMM_CB5: J14.87(CB5/NC)
DDR4_SODIMM_CB6: J14.100(CB6/NC)
DDR4_SODIMM_CB7: J14.104(CB7/NC)
DDR4_SODIMM_CK0_C: J14.139(CK0_c)
DDR4_SODIMM_CK0_T: J14.137(CK0_t)
DDR4_SODIMM_CK1_C: J14.140(CK1_c/NF)
DDR4_SODIMM_CK1_T: J14.138(CK1_t/NF)
DDR4_SODIMM_CKE0: J14.109(CKE0) R108.1
DDR4_SODIMM_CKE1: J14.110(CKE1/_NC) R109.1
DDR4_SODIMM_CS0_B: J14.149(CS0_n)
DDR4_SODIMM_CS1_B: J14.157(CS1_n/_NC)
DDR4_SODIMM_CS2_B: J14.162(C0/_CS2_n/NC) R115.1
DDR4_SODIMM_CS3_B: J14.165(C1/CS3_n/NC) R114.1
DDR4_SODIMM_DM0_B: J14.12(DM0_n/_DBI0_n)
DDR4_SODIMM_DM1_B: J14.33(DM1_n/_DBI1_n)
DDR4_SODIMM_DM2_B: J14.54(DM2_n/_DBI2_n)
DDR4_SODIMM_DM3_B: J14.75(DM3_n/_DBI3_n)
DDR4_SODIMM_DM4_B: J14.178(DM4_n/_DBI4_n)
DDR4_SODIMM_DM5_B: J14.199(DM5_n/_DBI5_n)
DDR4_SODIMM_DM6_B: J14.220(DM6_n/_DBI6_n)
DDR4_SODIMM_DM7_B: J14.241(DM7_n/_DBI7_n)
DDR4_SODIMM_DM8_B: J14.96(DM8_n/_DBI8_n/NC)
DDR4_SODIMM_DQ0: J14.8(DQ0)
DDR4_SODIMM_DQ1: J14.7(DQ1)
DDR4_SODIMM_DQ2: J14.20(DQ2)
DDR4_SODIMM_DQ3: J14.21(DQ3)
DDR4_SODIMM_DQ4: J14.4(DQ4)
DDR4_SODIMM_DQ5: J14.3(DQ5)
DDR4_SODIMM_DQ6: J14.16(DQ6)
DDR4_SODIMM_DQ7: J14.17(DQ7)
DDR4_SODIMM_DQ8: J14.28(DQ8)
DDR4_SODIMM_DQ9: J14.29(DQ9)
DDR4_SODIMM_DQ10: J14.41(DQ10)
DDR4_SODIMM_DQ11: J14.42(DQ11)
DDR4_SODIMM_DQ12: J14.24(DQ12)
DDR4_SODIMM_DQ13: J14.25(DQ13)
DDR4_SODIMM_DQ14: J14.38(DQ14)
DDR4_SODIMM_DQ15: J14.37(DQ15)
DDR4_SODIMM_DQ16: J14.50(DQ16)
DDR4_SODIMM_DQ17: J14.49(DQ17)
DDR4_SODIMM_DQ18: J14.62(DQ18)
DDR4_SODIMM_DQ19: J14.63(DQ19)
DDR4_SODIMM_DQ20: J14.46(DQ20)
DDR4_SODIMM_DQ21: J14.45(DQ21)
DDR4_SODIMM_DQ22: J14.58(DQ22)
DDR4_SODIMM_DQ23: J14.59(DQ23)
DDR4_SODIMM_DQ24: J14.70(DQ24)
DDR4_SODIMM_DQ25: J14.71(DQ25)
DDR4_SODIMM_DQ26: J14.83(DQ26)
DDR4_SODIMM_DQ27: J14.84(DQ27)
DDR4_SODIMM_DQ28: J14.66(DQ28)
DDR4_SODIMM_DQ29: J14.67(DQ29)
DDR4_SODIMM_DQ30: J14.79(DQ30)
DDR4_SODIMM_DQ31: J14.80(DQ31)
DDR4_SODIMM_DQ32: J14.174(DQ32)
DDR4_SODIMM_DQ33: J14.173(DQ33)
DDR4_SODIMM_DQ34: J14.187(DQ34)
DDR4_SODIMM_DQ35: J14.186(DQ35)
DDR4_SODIMM_DQ36: J14.170(DQ36)
DDR4_SODIMM_DQ37: J14.169(DQ37)
DDR4_SODIMM_DQ38: J14.183(DQ38)
DDR4_SODIMM_DQ39: J14.182(DQ39)
DDR4_SODIMM_DQ40: J14.195(DQ40)
DDR4_SODIMM_DQ41: J14.194(DQ41)
DDR4_SODIMM_DQ42: J14.207(DQ42)
DDR4_SODIMM_DQ43: J14.208(DQ43)
DDR4_SODIMM_DQ44: J14.191(DQ44)
DDR4_SODIMM_DQ45: J14.190(DQ45)
DDR4_SODIMM_DQ46: J14.203(DQ46)
DDR4_SODIMM_DQ47: J14.204(DQ47)
DDR4_SODIMM_DQ48: J14.216(DQ48)
DDR4_SODIMM_DQ49: J14.215(DQ49)
DDR4_SODIMM_DQ50: J14.228(DQ50)
DDR4_SODIMM_DQ51: J14.229(DQ51)
DDR4_SODIMM_DQ52: J14.211(DQ52)
DDR4_SODIMM_DQ53: J14.212(DQ53)
DDR4_SODIMM_DQ54: J14.224(DQ54)
DDR4_SODIMM_DQ55: J14.225(DQ55)
DDR4_SODIMM_DQ56: J14.237(DQ56)
DDR4_SODIMM_DQ57: J14.236(DQ57)
DDR4_SODIMM_DQ58: J14.249(DQ58)
DDR4_SODIMM_DQ59: J14.250(DQ59)
DDR4_SODIMM_DQ60: J14.232(DQ60)
DDR4_SODIMM_DQ61: J14.233(DQ61)
DDR4_SODIMM_DQ62: J14.245(DQ62)
DDR4_SODIMM_DQ63: J14.246(DQ63)
DDR4_SODIMM_DQS0_C: J14.11(DQS0_c)
DDR4_SODIMM_DQS0_T: J14.13(DQS0_t)
DDR4_SODIMM_DQS1_C: J14.32(DQS1_c)
DDR4_SODIMM_DQS1_T: J14.34(DQS1_t)
DDR4_SODIMM_DQS2_C: J14.53(DQS2_c)
DDR4_SODIMM_DQS2_T: J14.55(DQS2_t)
DDR4_SODIMM_DQS3_C: J14.74(DQS3_c)
DDR4_SODIMM_DQS3_T: J14.76(DQS3_t)
DDR4_SODIMM_DQS4_C: J14.177(DQS4_c)
DDR4_SODIMM_DQS4_T: J14.179(DQS4_t)
DDR4_SODIMM_DQS5_C: J14.198(DQS5_c)
DDR4_SODIMM_DQS5_T: J14.200(DQS5_t)
DDR4_SODIMM_DQS6_C: J14.219(DQS6_c)
DDR4_SODIMM_DQS6_T: J14.221(DQS6_t)
DDR4_SODIMM_DQS7_C: J14.240(DQS7_c)
DDR4_SODIMM_DQS7_T: J14.242(DQS7_t)
DDR4_SODIMM_DQS8_C: J14.95(DQS8_c)
DDR4_SODIMM_DQS8_T: J14.97(DQS8_t)
DDR4_SODIMM_EVENT_B: J14.134(EVENT_n/NF) R113.1
DDR4_SODIMM_ODT0: J14.155(ODT0)
DDR4_SODIMM_ODT1: J14.161(ODT1/_NC)
DDR4_SODIMM_PARITY: J14.143(PARITY)
DDR4_SODIMM_RAS_B: J14.152(RAS_n/_A16)
DDR4_SODIMM_RESET_B: J14.108(RESET_n)  [also labelled ZYNQ_DDR4_SODIMM_RESET_B]
DDR4_SODIMM_SA0: J14.256(SA0) R112.1
DDR4_SODIMM_SA1: J14.260(SA1) R111.1
DDR4_SODIMM_SA2: J14.166(SA2) R110.1
DDR4_SODIMM_SCL: J14.253(SCL)  [project net DDR4_SODIMM_PL_SCL]
DDR4_SODIMM_SDA: J14.254(SDA)  [project net DDR4_SODIMM_PL_SDA]
DDR4_SODIMM_VREF: C158.2 J14.164(VREFCA) R107.1 R116.2
DDR4_SODIMM_WE_B: J14.151(WE_n/_A14)

### Notes on the sheet
- PS DDR4 SODIMM
- FIXME: Check pin assignments and names of power signals!
- IIC Address = 0b1010001 (0x51)
- SODIMM SA[2:0]=001
- check this!
- NOTE: I2C interface is 2.5V
- PS DDR4 SODIMM Decoupling
- DNP
- Layout Directive:
  Place 0.1uF cap under memory
  adjacent to pin ?
- FIXME: Check names of power signals!
- PLACE ABOVE CAPS BENEATH/CLOSE TO DIMM SOCKET

### Library data of the parts
C151 C157-C168 = CAPCER0402X7R100N25V_10T: as C77 on sheet JTAG; Package: 0402; ComponentLink1Description: Datasheet; Value: 100nF; Voltage: 25V; Temperature Coefficient: X7R; Supplier 1: Digi-Key; Supplier Part Number 1: 490-10698-1-ND; Operating Temperature: -55°C ~ 125°C
C152-C155 = CAPCER0402X5R4U710V_10T: CAP CER 4.7UF 10V X5R 0402; Manufacturer 1: TDK Corporation; Manufacturer Part Number 1: C1005X5R1A475K050BC; Tolerance: 10%; Package: 0402; ComponentLink1Description: Datasheet; Value: 4.7uF; Voltage: 10V; Temperature Coefficient: x5R; Supplier 1: Digi-Key; Supplier Part Number 1: 445-13820-1-ND; Operating Temperature: -55°C ~ 85°C
C156 = CAPCER1210X5R100U16V_20T: CAP CER 100UF 16V X5R 1210; Manufacturer 1: Taiyo Yuden; Manufacturer Part Number 1: EMK325ABJ107MM-T; Tolerance: 20%; Package: 1210; ComponentLink1Description: Datasheet; Value: 100uF; Voltage: 16V; Temperature Coefficient: X5R; Supplier 1: Digi-Key; Supplier Part Number 1: 587-3152-1-ND; Operating Temperature: -55°C ~ 85°C
J14 = 2309409-2: DDR4 SODIMM 260P 5.2H STD; Manufacturer 1: TE; ComponentLink1Description: Datasheet; ComponentLink1URL: C:\Users\Public\Documents\Altium\AD16\Library\PDF\ENG_CD_2309409_3.pdf; Supplier 1: Digi-Key; Manufacturer Part Number 1: 2309409-2; Operating Temperature: -55 – 85 °C; Height: 5.2mm
R107 R116 = RES0402_100R_0W1_1T: as R7 on sheet JTAG; Package: 0402; ComponentLink1Description: Datasheet; Power: 1/10W; Tolerance: 1%; Supplier 1: Digi-Key; Supplier Part Number 1: P100LCT-ND
R108-R115 = RES0402_4K7_0W1_1T: as R8 on sheet JTAG; Package: 0402; ComponentLink1Description: Datasheet; Power: 1/10W; Tolerance: 1%; Supplier 1: Digi-Key; Supplier Part Number 1: P4.70KLCT-ND

## Sheet PL_DDR4_SODIMM.SchDoc
size A3
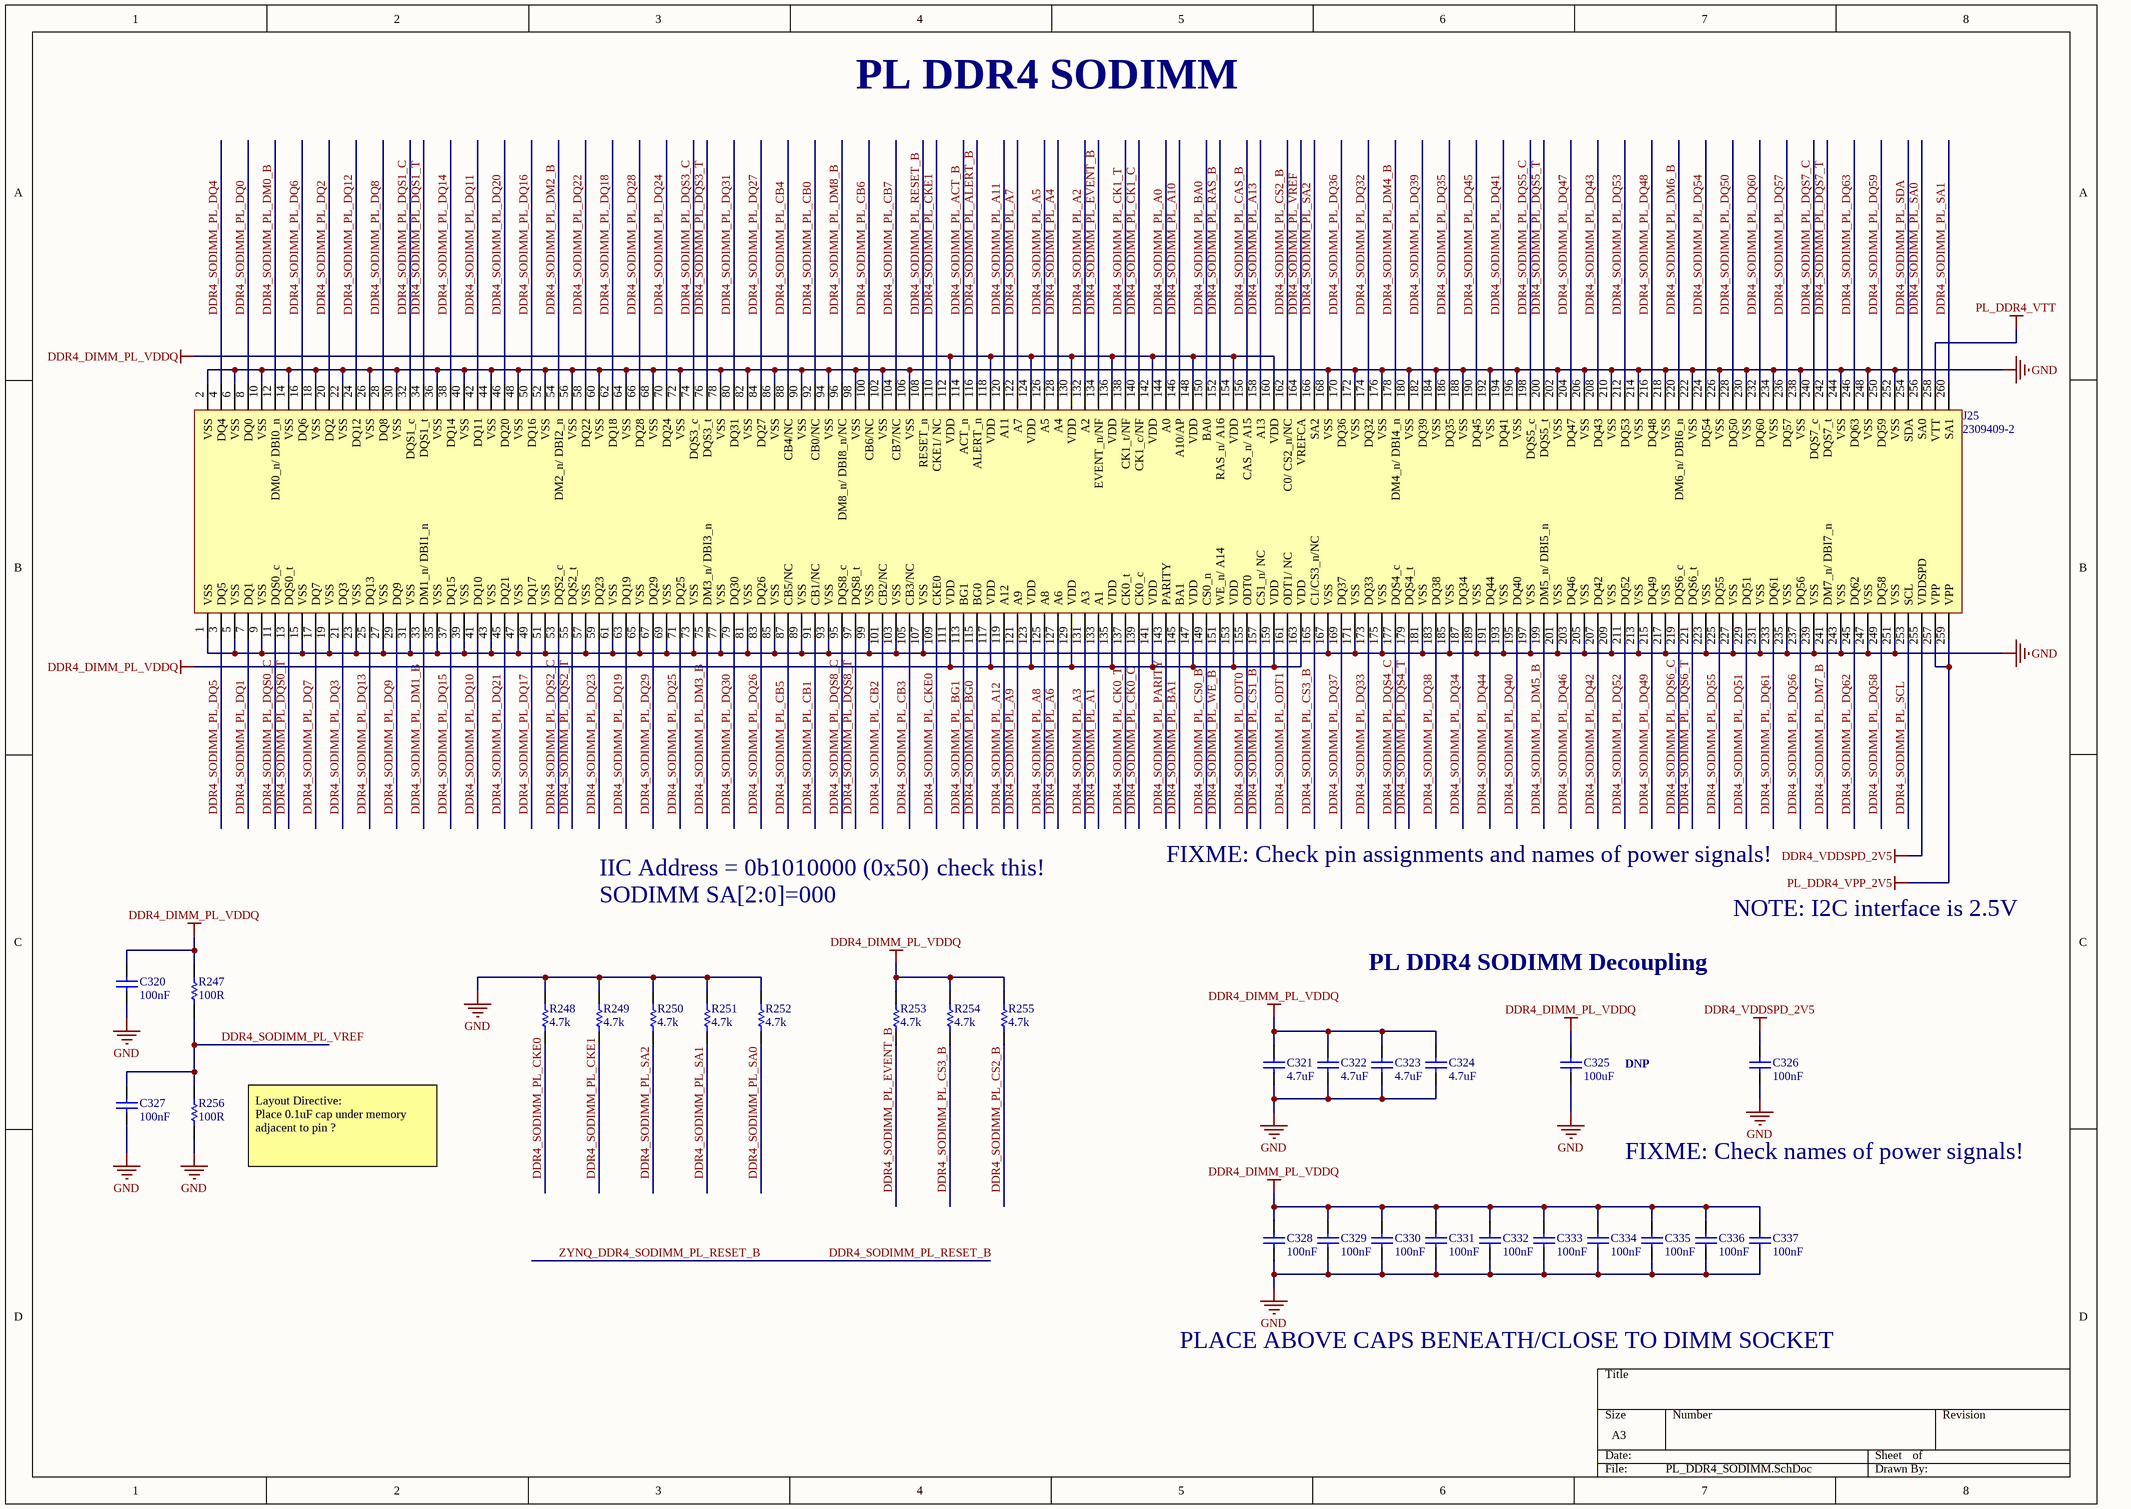
[diagram p10: PL_DDR4_SODIMM.SchDoc]

### Parts
C320  100nF  [CAPC1005L_0402]
C321  4.7uF  [CAPC1005L_0402]
C322  4.7uF  [CAPC1005L_0402]
C323  4.7uF  [CAPC1005L_0402]
C324  4.7uF  [CAPC1005L_0402]
C325  100uF  [CAPC3225N_1210]
C326  100nF  [CAPC1005L_0402]
C327  100nF  [CAPC1005L_0402]
C328  100nF  [CAPC1005L_0402]
C329  100nF  [CAPC1005L_0402]
C330  100nF  [CAPC1005L_0402]
C331  100nF  [CAPC1005L_0402]
C332  100nF  [CAPC1005L_0402]
C333  100nF  [CAPC1005L_0402]
C334  100nF  [CAPC1005L_0402]
C335  100nF  [CAPC1005L_0402]
C336  100nF  [CAPC1005L_0402]
C337  100nF  [CAPC1005L_0402]
J25  2309409-2  [DDR4_SODIMM_MATING]
R247  value 100R  [RESC1005L_0402]  (hidden comment: RES0402_100R_0W1_1T)
R248  value 4.7k  [RESC1005L_0402]  (hidden comment: RES0402_4K7_0W1_1T)
R249  value 4.7k  [RESC1005L_0402]  (hidden comment: RES0402_4K7_0W1_1T)
R250  value 4.7k  [RESC1005L_0402]  (hidden comment: RES0402_4K7_0W1_1T)
R251  value 4.7k  [RESC1005L_0402]  (hidden comment: RES0402_4K7_0W1_1T)
R252  value 4.7k  [RESC1005L_0402]  (hidden comment: RES0402_4K7_0W1_1T)
R253  value 4.7k  [RESC1005L_0402]  (hidden comment: RES0402_4K7_0W1_1T)
R254  value 4.7k  [RESC1005L_0402]  (hidden comment: RES0402_4K7_0W1_1T)
R255  value 4.7k  [RESC1005L_0402]  (hidden comment: RES0402_4K7_0W1_1T)
R256  value 100R  [RESC1005L_0402]  (hidden comment: RES0402_100R_0W1_1T)

### Nets
DDR4_DIMM_PL_VDDQ: C320.2 C321.2 C322.2 C323.2 C324.2 C325.2 C328.2 C329.2 C330.2 C331.2 C332.2 C333.2 C334.2 C335.2 C336.2 C337.2 J25.111(VDD) J25.112(VDD) J25.117(VDD) J25.118(VDD) J25.123(VDD) J25.124(VDD) J25.129(VDD) J25.130(VDD) J25.135(VDD) J25.136(VDD) J25.141(VDD) J25.142(VDD) J25.147(VDD) J25.148(VDD) J25.153(VDD) J25.154(VDD) J25.159(VDD) J25.160(VDD) J25.163(VDD) R247.2 R253.2 R254.2 R255.2  [project net +VCCO_HP_64]
DDR4_VDDSPD_2V5: C326.2 J25.255(VDDSPD)
GND: C320.1 C321.1 C322.1 C323.1 C324.1 C325.1 C326.1 C327.1 C328.1 C329.1 C330.1 C331.1 C332.1 C333.1 C334.1 C335.1 C336.1 C337.1 J25.1(VSS) J25.2(VSS) J25.5(VSS) J25.6(VSS) J25.9(VSS) J25.10(VSS) J25.14(VSS) J25.15(VSS) J25.18(VSS) J25.19(VSS) J25.22(VSS) J25.23(VSS) J25.26(VSS) J25.27(VSS) J25.30(VSS) J25.31(VSS) J25.35(VSS) J25.36(VSS) J25.39(VSS) J25.40(VSS) J25.43(VSS) J25.44(VSS) J25.47(VSS) J25.48(VSS) J25.51(VSS) J25.52(VSS) J25.56(VSS) J25.57(VSS) J25.60(VSS) J25.61(VSS) J25.64(VSS) J25.65(VSS) J25.68(VSS) J25.69(VSS) J25.72(VSS) J25.73(VSS) J25.77(VSS) J25.78(VSS) J25.81(VSS) J25.82(VSS) J25.85(VSS) J25.86(VSS) J25.89(VSS) J25.90(VSS) J25.93(VSS) J25.94(VSS) J25.98(VSS) J25.99(VSS) J25.102(VSS) J25.103(VSS) J25.106(VSS) J25.107(VSS) J25.167(VSS) J25.168(VSS) J25.171(VSS) J25.172(VSS) J25.175(VSS) J25.176(VSS) J25.180(VSS) J25.181(VSS) J25.184(VSS) J25.185(VSS) J25.188(VSS) J25.189(VSS) J25.192(VSS) J25.193(VSS) J25.196(VSS) J25.197(VSS) J25.201(VSS) J25.202(VSS) J25.205(VSS) J25.206(VSS) J25.209(VSS) J25.210(VSS) J25.213(VSS) J25.214(VSS) J25.217(VSS) J25.218(VSS) J25.222(VSS) J25.223(VSS) J25.226(VSS) J25.227(VSS) J25.230(VSS) J25.231(VSS) J25.234(VSS) J25.235(VSS) J25.238(VSS) J25.239(VSS) J25.243(VSS) J25.244(VSS) J25.247(VSS) J25.248(VSS) J25.251(VSS) J25.252(VSS) R248.2 R249.2 R250.2 R251.2 R252.2 R256.1
PL_DDR4_VPP_2V5: J25.257(VPP) J25.259(VPP)
PL_DDR4_VTT: J25.258(VTT)
DDR4_SODIMM_PL_A0: J25.144(A0)
DDR4_SODIMM_PL_A1: J25.133(A1)
DDR4_SODIMM_PL_A2: J25.132(A2)
DDR4_SODIMM_PL_A3: J25.131(A3)
DDR4_SODIMM_PL_A4: J25.128(A4)
DDR4_SODIMM_PL_A5: J25.126(A5)
DDR4_SODIMM_PL_A6: J25.127(A6)
DDR4_SODIMM_PL_A7: J25.122(A7)
DDR4_SODIMM_PL_A8: J25.125(A8)
DDR4_SODIMM_PL_A9: J25.121(A9)
DDR4_SODIMM_PL_A10: J25.146(A10/AP)
DDR4_SODIMM_PL_A11: J25.120(A11)
DDR4_SODIMM_PL_A12: J25.119(A12)
DDR4_SODIMM_PL_A13: J25.158(A13)
DDR4_SODIMM_PL_ACT_B: J25.114(ACT_n)
DDR4_SODIMM_PL_ALERT_B: J25.116(ALERT_n)
DDR4_SODIMM_PL_BA0: J25.150(BA0)
DDR4_SODIMM_PL_BA1: J25.145(BA1)
DDR4_SODIMM_PL_BG0: J25.115(BG0)
DDR4_SODIMM_PL_BG1: J25.113(BG1)
DDR4_SODIMM_PL_CAS_B: J25.156(CAS_n/_A15)
DDR4_SODIMM_PL_CB0: J25.92(CB0/NC)
DDR4_SODIMM_PL_CB1: J25.91(CB1/NC)
DDR4_SODIMM_PL_CB2: J25.101(CB2/NC)
DDR4_SODIMM_PL_CB3: J25.105(CB3/NC)
DDR4_SODIMM_PL_CB4: J25.88(CB4/NC)
DDR4_SODIMM_PL_CB5: J25.87(CB5/NC)
DDR4_SODIMM_PL_CB6: J25.100(CB6/NC)
DDR4_SODIMM_PL_CB7: J25.104(CB7/NC)
DDR4_SODIMM_PL_CK0_C: J25.139(CK0_c)
DDR4_SODIMM_PL_CK0_T: J25.137(CK0_t)
DDR4_SODIMM_PL_CK1_C: J25.140(CK1_c/NF)
DDR4_SODIMM_PL_CK1_T: J25.138(CK1_t/NF)
DDR4_SODIMM_PL_CKE0: J25.109(CKE0) R248.1
DDR4_SODIMM_PL_CKE1: J25.110(CKE1/_NC) R249.1
DDR4_SODIMM_PL_CS0_B: J25.149(CS0_n)
DDR4_SODIMM_PL_CS1_B: J25.157(CS1_n/_NC)
DDR4_SODIMM_PL_CS2_B: J25.162(C0/_CS2_n/NC) R255.1
DDR4_SODIMM_PL_CS3_B: J25.165(C1/CS3_n/NC) R254.1
DDR4_SODIMM_PL_DM0_B: J25.12(DM0_n/_DBI0_n)
DDR4_SODIMM_PL_DM1_B: J25.33(DM1_n/_DBI1_n)
DDR4_SODIMM_PL_DM2_B: J25.54(DM2_n/_DBI2_n)
DDR4_SODIMM_PL_DM3_B: J25.75(DM3_n/_DBI3_n)
DDR4_SODIMM_PL_DM4_B: J25.178(DM4_n/_DBI4_n)
DDR4_SODIMM_PL_DM5_B: J25.199(DM5_n/_DBI5_n)
DDR4_SODIMM_PL_DM6_B: J25.220(DM6_n/_DBI6_n)
DDR4_SODIMM_PL_DM7_B: J25.241(DM7_n/_DBI7_n)
DDR4_SODIMM_PL_DM8_B: J25.96(DM8_n/_DBI8_n/NC)
DDR4_SODIMM_PL_DQ0: J25.8(DQ0)
DDR4_SODIMM_PL_DQ1: J25.7(DQ1)
DDR4_SODIMM_PL_DQ2: J25.20(DQ2)
DDR4_SODIMM_PL_DQ3: J25.21(DQ3)
DDR4_SODIMM_PL_DQ4: J25.4(DQ4)
DDR4_SODIMM_PL_DQ5: J25.3(DQ5)
DDR4_SODIMM_PL_DQ6: J25.16(DQ6)
DDR4_SODIMM_PL_DQ7: J25.17(DQ7)
DDR4_SODIMM_PL_DQ8: J25.28(DQ8)
DDR4_SODIMM_PL_DQ9: J25.29(DQ9)
DDR4_SODIMM_PL_DQ10: J25.41(DQ10)
DDR4_SODIMM_PL_DQ11: J25.42(DQ11)
DDR4_SODIMM_PL_DQ12: J25.24(DQ12)
DDR4_SODIMM_PL_DQ13: J25.25(DQ13)
DDR4_SODIMM_PL_DQ14: J25.38(DQ14)
DDR4_SODIMM_PL_DQ15: J25.37(DQ15)
DDR4_SODIMM_PL_DQ16: J25.50(DQ16)
DDR4_SODIMM_PL_DQ17: J25.49(DQ17)
DDR4_SODIMM_PL_DQ18: J25.62(DQ18)
DDR4_SODIMM_PL_DQ19: J25.63(DQ19)
DDR4_SODIMM_PL_DQ20: J25.46(DQ20)
DDR4_SODIMM_PL_DQ21: J25.45(DQ21)
DDR4_SODIMM_PL_DQ22: J25.58(DQ22)
DDR4_SODIMM_PL_DQ23: J25.59(DQ23)
DDR4_SODIMM_PL_DQ24: J25.70(DQ24)
DDR4_SODIMM_PL_DQ25: J25.71(DQ25)
DDR4_SODIMM_PL_DQ26: J25.83(DQ26)
DDR4_SODIMM_PL_DQ27: J25.84(DQ27)
DDR4_SODIMM_PL_DQ28: J25.66(DQ28)
DDR4_SODIMM_PL_DQ29: J25.67(DQ29)
DDR4_SODIMM_PL_DQ30: J25.79(DQ30)
DDR4_SODIMM_PL_DQ31: J25.80(DQ31)
DDR4_SODIMM_PL_DQ32: J25.174(DQ32)
DDR4_SODIMM_PL_DQ33: J25.173(DQ33)
DDR4_SODIMM_PL_DQ34: J25.187(DQ34)
DDR4_SODIMM_PL_DQ35: J25.186(DQ35)
DDR4_SODIMM_PL_DQ36: J25.170(DQ36)
DDR4_SODIMM_PL_DQ37: J25.169(DQ37)
DDR4_SODIMM_PL_DQ38: J25.183(DQ38)
DDR4_SODIMM_PL_DQ39: J25.182(DQ39)
DDR4_SODIMM_PL_DQ40: J25.195(DQ40)
DDR4_SODIMM_PL_DQ41: J25.194(DQ41)
DDR4_SODIMM_PL_DQ42: J25.207(DQ42)
DDR4_SODIMM_PL_DQ43: J25.208(DQ43)
DDR4_SODIMM_PL_DQ44: J25.191(DQ44)
DDR4_SODIMM_PL_DQ45: J25.190(DQ45)
DDR4_SODIMM_PL_DQ46: J25.203(DQ46)
DDR4_SODIMM_PL_DQ47: J25.204(DQ47)
DDR4_SODIMM_PL_DQ48: J25.216(DQ48)
DDR4_SODIMM_PL_DQ49: J25.215(DQ49)
DDR4_SODIMM_PL_DQ50: J25.228(DQ50)
DDR4_SODIMM_PL_DQ51: J25.229(DQ51)
DDR4_SODIMM_PL_DQ52: J25.211(DQ52)
DDR4_SODIMM_PL_DQ53: J25.212(DQ53)
DDR4_SODIMM_PL_DQ54: J25.224(DQ54)
DDR4_SODIMM_PL_DQ55: J25.225(DQ55)
DDR4_SODIMM_PL_DQ56: J25.237(DQ56)
DDR4_SODIMM_PL_DQ57: J25.236(DQ57)
DDR4_SODIMM_PL_DQ58: J25.249(DQ58)
DDR4_SODIMM_PL_DQ59: J25.250(DQ59)
DDR4_SODIMM_PL_DQ60: J25.232(DQ60)
DDR4_SODIMM_PL_DQ61: J25.233(DQ61)
DDR4_SODIMM_PL_DQ62: J25.245(DQ62)
DDR4_SODIMM_PL_DQ63: J25.246(DQ63)
DDR4_SODIMM_PL_DQS0_C: J25.11(DQS0_c)
DDR4_SODIMM_PL_DQS0_T: J25.13(DQS0_t)
DDR4_SODIMM_PL_DQS1_C: J25.32(DQS1_c)
DDR4_SODIMM_PL_DQS1_T: J25.34(DQS1_t)
DDR4_SODIMM_PL_DQS2_C: J25.53(DQS2_c)
DDR4_SODIMM_PL_DQS2_T: J25.55(DQS2_t)
DDR4_SODIMM_PL_DQS3_C: J25.74(DQS3_c)
DDR4_SODIMM_PL_DQS3_T: J25.76(DQS3_t)
DDR4_SODIMM_PL_DQS4_C: J25.177(DQS4_c)
DDR4_SODIMM_PL_DQS4_T: J25.179(DQS4_t)
DDR4_SODIMM_PL_DQS5_C: J25.198(DQS5_c)
DDR4_SODIMM_PL_DQS5_T: J25.200(DQS5_t)
DDR4_SODIMM_PL_DQS6_C: J25.219(DQS6_c)
DDR4_SODIMM_PL_DQS6_T: J25.221(DQS6_t)
DDR4_SODIMM_PL_DQS7_C: J25.240(DQS7_c)
DDR4_SODIMM_PL_DQS7_T: J25.242(DQS7_t)
DDR4_SODIMM_PL_DQS8_C: J25.95(DQS8_c)
DDR4_SODIMM_PL_DQS8_T: J25.97(DQS8_t)
DDR4_SODIMM_PL_EVENT_B: J25.134(EVENT_n/NF) R253.1
DDR4_SODIMM_PL_ODT0: J25.155(ODT0)
DDR4_SODIMM_PL_ODT1: J25.161(ODT1/_NC)
DDR4_SODIMM_PL_PARITY: J25.143(PARITY)
DDR4_SODIMM_PL_RAS_B: J25.152(RAS_n/_A16)
DDR4_SODIMM_PL_RESET_B: J25.108(RESET_n)  [also labelled ZYNQ_DDR4_SODIMM_PL_RESET_B]
DDR4_SODIMM_PL_SA0: J25.256(SA0) R252.1
DDR4_SODIMM_PL_SA1: J25.260(SA1) R251.1
DDR4_SODIMM_PL_SA2: J25.166(SA2) R250.1
DDR4_SODIMM_PL_SCL: J25.253(SCL)
DDR4_SODIMM_PL_SDA: J25.254(SDA)
DDR4_SODIMM_PL_VREF: C327.2 J25.164(VREFCA) R247.1 R256.2
DDR4_SODIMM_PL_WE_B: J25.151(WE_n/_A14)

### Notes on the sheet
- PL DDR4 SODIMM
- IIC Address = 0b1010000 (0x50)
- SODIMM SA[2:0]=000
- check this!
- FIXME: Check pin assignments and names of power signals!
- NOTE: I2C interface is 2.5V
- PL DDR4 SODIMM Decoupling
- DNP
- Layout Directive:
  Place 0.1uF cap under memory
  adjacent to pin ?
- FIXME: Check names of power signals!
- PLACE ABOVE CAPS BENEATH/CLOSE TO DIMM SOCKET

### Library data of the parts
C320 C326-C337 = CAPCER0402X7R100N25V_10T: as C77 on sheet JTAG; Package: 0402; ComponentLink1Description: Datasheet; Value: 100nF; Voltage: 25V; Temperature Coefficient: X7R; Supplier 1: Digi-Key; Supplier Part Number 1: 490-10698-1-ND; Operating Temperature: -55°C ~ 125°C
C321-C324 = CAPCER0402X5R4U710V_10T: as C152-C155 on sheet PS_DDR4_SODIMM; Package: 0402; ComponentLink1Description: Datasheet; Value: 4.7uF; Voltage: 10V; Temperature Coefficient: x5R; Supplier 1: Digi-Key; Supplier Part Number 1: 445-13820-1-ND; Operating Temperature: -55°C ~ 85°C
C325 = CAPCER1210X5R100U16V_20T: as C156 on sheet PS_DDR4_SODIMM; Package: 1210; ComponentLink1Description: Datasheet; Value: 100uF; Voltage: 16V; Temperature Coefficient: X5R; Supplier 1: Digi-Key; Supplier Part Number 1: 587-3152-1-ND; Operating Temperature: -55°C ~ 85°C
J25 = 2309409-2: as J14 on sheet PS_DDR4_SODIMM; ComponentLink1Description: Datasheet; ComponentLink1URL: C:\Users\Public\Documents\Altium\AD16\Library\PDF\ENG_CD_2309409_3.pdf; Supplier 1: Digi-Key; Manufacturer Part Number 1: 2309409-2; Operating Temperature: -55 – 85 °C; Height: 5.2mm
R247 R256 = RES0402_100R_0W1_1T: as R7 on sheet JTAG; Package: 0402; ComponentLink1Description: Datasheet; Power: 1/10W; Tolerance: 1%; Supplier 1: Digi-Key; Supplier Part Number 1: P100LCT-ND
R248-R255 = RES0402_4K7_0W1_1T: as R8 on sheet JTAG; Package: 0402; ComponentLink1Description: Datasheet; Power: 1/10W; Tolerance: 1%; Supplier 1: Digi-Key; Supplier Part Number 1: P4.70KLCT-ND

## Sheet PS_DDR4.SchDoc
size A3
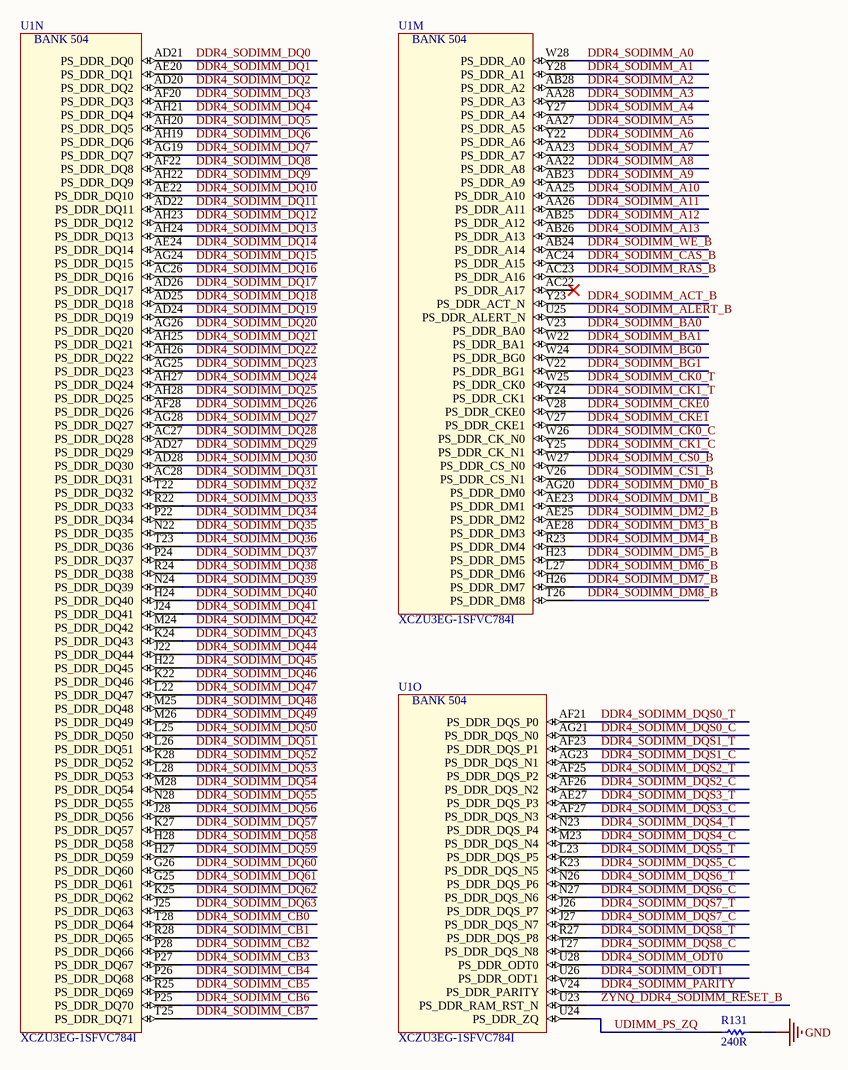
[diagram p11: PS_DDR4.SchDoc]

### Parts
R131  value 240R  [RESC1005L_0402]  (hidden comment: RES0402_240R_0W1_1T)
U1  XCZU3EG-1SFVC784I  [BGA784x28]  (parts M,N,O of 22)

### Nets
GND: R131.1
DDR4_SODIMM_A0: U1.W28(PS_DDR_A0)
DDR4_SODIMM_A1: U1.Y28(PS_DDR_A1)
DDR4_SODIMM_A2: U1.AB28(PS_DDR_A2)
DDR4_SODIMM_A3: U1.AA28(PS_DDR_A3)
DDR4_SODIMM_A4: U1.Y27(PS_DDR_A4)
DDR4_SODIMM_A5: U1.AA27(PS_DDR_A5)
DDR4_SODIMM_A6: U1.Y22(PS_DDR_A6)
DDR4_SODIMM_A7: U1.AA23(PS_DDR_A7)
DDR4_SODIMM_A8: U1.AA22(PS_DDR_A8)
DDR4_SODIMM_A9: U1.AB23(PS_DDR_A9)
DDR4_SODIMM_A10: U1.AA25(PS_DDR_A10)
DDR4_SODIMM_A11: U1.AA26(PS_DDR_A11)
DDR4_SODIMM_A12: U1.AB25(PS_DDR_A12)
DDR4_SODIMM_A13: U1.AB26(PS_DDR_A13)
DDR4_SODIMM_ACT_B: U1.Y23(PS_DDR_ACT_N)
DDR4_SODIMM_ALERT_B: U1.U25(PS_DDR_ALERT_N)
DDR4_SODIMM_BA0: U1.V23(PS_DDR_BA0)
DDR4_SODIMM_BA1: U1.W22(PS_DDR_BA1)
DDR4_SODIMM_BG0: U1.W24(PS_DDR_BG0)
DDR4_SODIMM_BG1: U1.V22(PS_DDR_BG1)
DDR4_SODIMM_CAS_B: U1.AC24(PS_DDR_A15)
DDR4_SODIMM_CB0: U1.T28(PS_DDR_DQ64)
DDR4_SODIMM_CB1: U1.R28(PS_DDR_DQ65)
DDR4_SODIMM_CB2: U1.P28(PS_DDR_DQ66)
DDR4_SODIMM_CB3: U1.P27(PS_DDR_DQ67)
DDR4_SODIMM_CB4: U1.P26(PS_DDR_DQ68)
DDR4_SODIMM_CB5: U1.R25(PS_DDR_DQ69)
DDR4_SODIMM_CB6: U1.P25(PS_DDR_DQ70)
DDR4_SODIMM_CB7: U1.T25(PS_DDR_DQ71)
DDR4_SODIMM_CK0_C: U1.W26(PS_DDR_CK_N0)
DDR4_SODIMM_CK0_T: U1.W25(PS_DDR_CK0)
DDR4_SODIMM_CK1_C: U1.Y25(PS_DDR_CK_N1)
DDR4_SODIMM_CK1_T: U1.Y24(PS_DDR_CK1)
DDR4_SODIMM_CKE0: U1.V28(PS_DDR_CKE0)
DDR4_SODIMM_CKE1: U1.V27(PS_DDR_CKE1)
DDR4_SODIMM_CS0_B: U1.W27(PS_DDR_CS_N0)
DDR4_SODIMM_CS1_B: U1.V26(PS_DDR_CS_N1)
DDR4_SODIMM_DM0_B: U1.AG20(PS_DDR_DM0)
DDR4_SODIMM_DM1_B: U1.AE23(PS_DDR_DM1)
DDR4_SODIMM_DM2_B: U1.AE25(PS_DDR_DM2)
DDR4_SODIMM_DM3_B: U1.AE28(PS_DDR_DM3)
DDR4_SODIMM_DM4_B: U1.R23(PS_DDR_DM4)
DDR4_SODIMM_DM5_B: U1.H23(PS_DDR_DM5)
DDR4_SODIMM_DM6_B: U1.L27(PS_DDR_DM6)
DDR4_SODIMM_DM7_B: U1.H26(PS_DDR_DM7)
DDR4_SODIMM_DM8_B: U1.T26(PS_DDR_DM8)
DDR4_SODIMM_DQ0: U1.AD21(PS_DDR_DQ0)
DDR4_SODIMM_DQ1: U1.AE20(PS_DDR_DQ1)
DDR4_SODIMM_DQ2: U1.AD20(PS_DDR_DQ2)
DDR4_SODIMM_DQ3: U1.AF20(PS_DDR_DQ3)
DDR4_SODIMM_DQ4: U1.AH21(PS_DDR_DQ4)
DDR4_SODIMM_DQ5: U1.AH20(PS_DDR_DQ5)
DDR4_SODIMM_DQ6: U1.AH19(PS_DDR_DQ6)
DDR4_SODIMM_DQ7: U1.AG19(PS_DDR_DQ7)
DDR4_SODIMM_DQ8: U1.AF22(PS_DDR_DQ8)
DDR4_SODIMM_DQ9: U1.AH22(PS_DDR_DQ9)
DDR4_SODIMM_DQ10: U1.AE22(PS_DDR_DQ10)
DDR4_SODIMM_DQ11: U1.AD22(PS_DDR_DQ11)
DDR4_SODIMM_DQ12: U1.AH23(PS_DDR_DQ12)
DDR4_SODIMM_DQ13: U1.AH24(PS_DDR_DQ13)
DDR4_SODIMM_DQ14: U1.AE24(PS_DDR_DQ14)
DDR4_SODIMM_DQ15: U1.AG24(PS_DDR_DQ15)
DDR4_SODIMM_DQ16: U1.AC26(PS_DDR_DQ16)
DDR4_SODIMM_DQ17: U1.AD26(PS_DDR_DQ17)
DDR4_SODIMM_DQ18: U1.AD25(PS_DDR_DQ18)
DDR4_SODIMM_DQ19: U1.AD24(PS_DDR_DQ19)
DDR4_SODIMM_DQ20: U1.AG26(PS_DDR_DQ20)
DDR4_SODIMM_DQ21: U1.AH25(PS_DDR_DQ21)
DDR4_SODIMM_DQ22: U1.AH26(PS_DDR_DQ22)
DDR4_SODIMM_DQ23: U1.AG25(PS_DDR_DQ23)
DDR4_SODIMM_DQ24: U1.AH27(PS_DDR_DQ24)
DDR4_SODIMM_DQ25: U1.AH28(PS_DDR_DQ25)
DDR4_SODIMM_DQ26: U1.AF28(PS_DDR_DQ26)
DDR4_SODIMM_DQ27: U1.AG28(PS_DDR_DQ27)
DDR4_SODIMM_DQ28: U1.AC27(PS_DDR_DQ28)
DDR4_SODIMM_DQ29: U1.AD27(PS_DDR_DQ29)
DDR4_SODIMM_DQ30: U1.AD28(PS_DDR_DQ30)
DDR4_SODIMM_DQ31: U1.AC28(PS_DDR_DQ31)
DDR4_SODIMM_DQ32: U1.T22(PS_DDR_DQ32)
DDR4_SODIMM_DQ33: U1.R22(PS_DDR_DQ33)
DDR4_SODIMM_DQ34: U1.P22(PS_DDR_DQ34)
DDR4_SODIMM_DQ35: U1.N22(PS_DDR_DQ35)
DDR4_SODIMM_DQ36: U1.T23(PS_DDR_DQ36)
DDR4_SODIMM_DQ37: U1.P24(PS_DDR_DQ37)
DDR4_SODIMM_DQ38: U1.R24(PS_DDR_DQ38)
DDR4_SODIMM_DQ39: U1.N24(PS_DDR_DQ39)
DDR4_SODIMM_DQ40: U1.H24(PS_DDR_DQ40)
DDR4_SODIMM_DQ41: U1.J24(PS_DDR_DQ41)
DDR4_SODIMM_DQ42: U1.M24(PS_DDR_DQ42)
DDR4_SODIMM_DQ43: U1.K24(PS_DDR_DQ43)
DDR4_SODIMM_DQ44: U1.J22(PS_DDR_DQ44)
DDR4_SODIMM_DQ45: U1.H22(PS_DDR_DQ45)
DDR4_SODIMM_DQ46: U1.K22(PS_DDR_DQ46)
DDR4_SODIMM_DQ47: U1.L22(PS_DDR_DQ47)
DDR4_SODIMM_DQ48: U1.M25(PS_DDR_DQ48)
DDR4_SODIMM_DQ49: U1.M26(PS_DDR_DQ49)
DDR4_SODIMM_DQ50: U1.L25(PS_DDR_DQ50)
DDR4_SODIMM_DQ51: U1.L26(PS_DDR_DQ51)
DDR4_SODIMM_DQ52: U1.K28(PS_DDR_DQ52)
DDR4_SODIMM_DQ53: U1.L28(PS_DDR_DQ53)
DDR4_SODIMM_DQ54: U1.M28(PS_DDR_DQ54)
DDR4_SODIMM_DQ55: U1.N28(PS_DDR_DQ55)
DDR4_SODIMM_DQ56: U1.J28(PS_DDR_DQ56)
DDR4_SODIMM_DQ57: U1.K27(PS_DDR_DQ57)
DDR4_SODIMM_DQ58: U1.H28(PS_DDR_DQ58)
DDR4_SODIMM_DQ59: U1.H27(PS_DDR_DQ59)
DDR4_SODIMM_DQ60: U1.G26(PS_DDR_DQ60)
DDR4_SODIMM_DQ61: U1.G25(PS_DDR_DQ61)
DDR4_SODIMM_DQ62: U1.K25(PS_DDR_DQ62)
DDR4_SODIMM_DQ63: U1.J25(PS_DDR_DQ63)
DDR4_SODIMM_DQS0_C: U1.AG21(PS_DDR_DQS_N0)
DDR4_SODIMM_DQS0_T: U1.AF21(PS_DDR_DQS_P0)
DDR4_SODIMM_DQS1_C: U1.AG23(PS_DDR_DQS_N1)
DDR4_SODIMM_DQS1_T: U1.AF23(PS_DDR_DQS_P1)
DDR4_SODIMM_DQS2_C: U1.AF26(PS_DDR_DQS_N2)
DDR4_SODIMM_DQS2_T: U1.AF25(PS_DDR_DQS_P2)
DDR4_SODIMM_DQS3_C: U1.AF27(PS_DDR_DQS_N3)
DDR4_SODIMM_DQS3_T: U1.AE27(PS_DDR_DQS_P3)
DDR4_SODIMM_DQS4_C: U1.M23(PS_DDR_DQS_N4)
DDR4_SODIMM_DQS4_T: U1.N23(PS_DDR_DQS_P4)
DDR4_SODIMM_DQS5_C: U1.K23(PS_DDR_DQS_N5)
DDR4_SODIMM_DQS5_T: U1.L23(PS_DDR_DQS_P5)
DDR4_SODIMM_DQS6_C: U1.N27(PS_DDR_DQS_N6)
DDR4_SODIMM_DQS6_T: U1.N26(PS_DDR_DQS_P6)
DDR4_SODIMM_DQS7_C: U1.J27(PS_DDR_DQS_N7)
DDR4_SODIMM_DQS7_T: U1.J26(PS_DDR_DQS_P7)
DDR4_SODIMM_DQS8_C: U1.T27(PS_DDR_DQS_N8)
DDR4_SODIMM_DQS8_T: U1.R27(PS_DDR_DQS_P8)
DDR4_SODIMM_ODT0: U1.U28(PS_DDR_ODT0)
DDR4_SODIMM_ODT1: U1.U26(PS_DDR_ODT1)
DDR4_SODIMM_PARITY: U1.V24(PS_DDR_PARITY)
DDR4_SODIMM_RAS_B: U1.AC23(PS_DDR_A16)
DDR4_SODIMM_WE_B: U1.AB24(PS_DDR_A14)
UDIMM_PS_ZQ: R131.2 U1.U24(PS_DDR_ZQ)
ZYNQ_DDR4_SODIMM_RESET_B: U1.U23(PS_DDR_RAM_RST_N)  [project net DDR4_SODIMM_RESET_B]

Not connected (* = marked no-connect by the designer): U1 AC22(PS_DDR_A17)*

### Notes on the sheet
- (in symbol XCZU3EG-1SFVC784I, part M) BANK 504
- (in symbol XCZU3EG-1SFVC784I, part N) BANK 504
- (in symbol XCZU3EG-1SFVC784I, part O) BANK 504

### Library data of the parts
R131 = RES0402_240R_0W1_1T: as R13 on sheet JTAG; Package: 0402; ComponentLink1Description: Datasheet; Power: 1/10W; Tolerance: 1%; Supplier 1: Digi-Key; Supplier Part Number 1: P240LCT-ND
U1 = XCZU3EG-1SFVC784I: as U1 on sheet JTAG; Package: SFVC784; ComponentLink1Description: Datasheet; Supplier 1: Digi-Key; Supplier Part Number 1: XCZU3EG-1SFVC784I-ND; Manufacturer Part Number 1: XCZU3EG-1SFVC784I